# Altium project ZYNQ-7000 SOM Bd.PrjPcb (part 1 of 2)
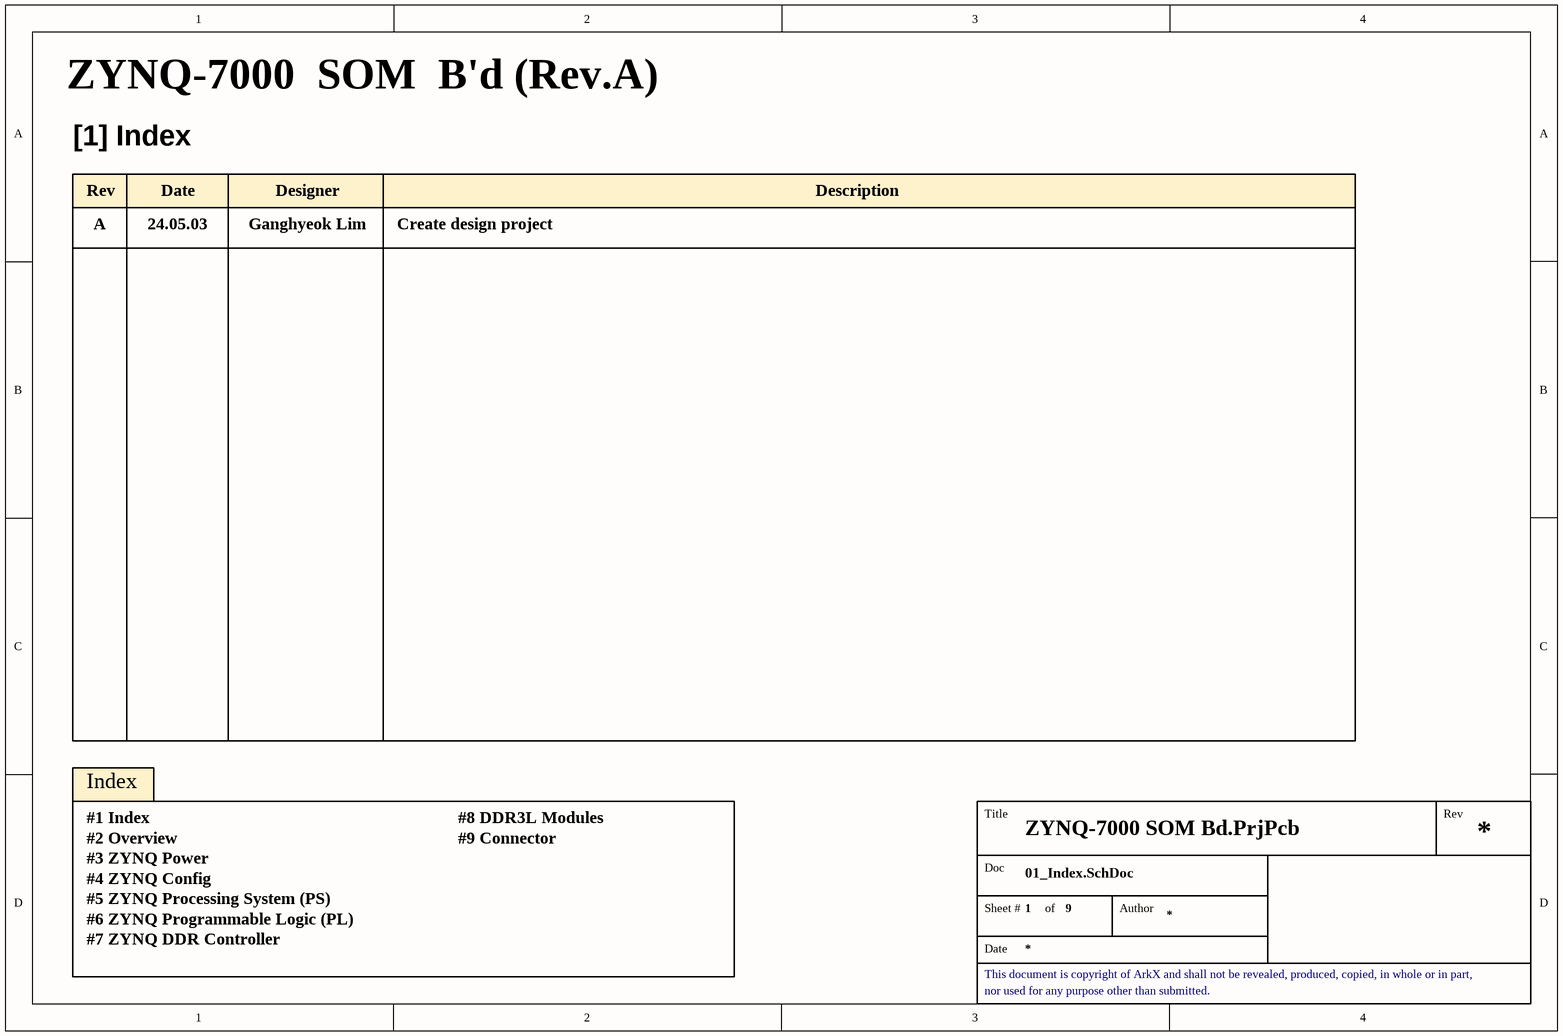
[diagram p0: 01_Index.SchDoc]
9 sheets, 246 parts. Net scope: global (net labels, ports and power ports of the same name join across sheets).
Board file: ZYNQ-7000_SOM_Bd.PcbDoc
Sheets:
  01_Index.SchDoc
  02_Overview.SchDoc
  03_ZYNQ_Power.SchDoc
  04_ZYNQ_Config.SchDoc
  05_ZYNQ_PS.SchDoc
  06_ZYNQ_PL.SchDoc
  07_ZYNQ_DDR.SchDoc
  08_DDR3L_Modules.SchDoc
  09_Connectors.SchDoc

## Sheet 01_Index.SchDoc
size A4; SheetNumber: 1; SheetTotal: 9

### Notes on the sheet
- ZYNQ-7000  SOM  B'd (Rev.A)
- [1] Index
- Rev
- A
- 24.05.03
- Date
- Ganghyeok Lim
- Designer
- Create design project
- Description
- Index
- #1 Index
- #2 Overview
- #8 DDR3L Modules
- #9 Connector
- #3 ZYNQ Power
- #4 ZYNQ Config
- #5 ZYNQ Processing System (PS)
- #6 ZYNQ Programmable Logic (PL)
- #7 ZYNQ DDR Controller
- Title
- Doc
- Sheet #
- of
- Author
- This document is copyright of ArkX and shall not be revealed, produced, copied, in whole or in part,
- nor used for any purpose other than submitted.

## Sheet 02_Overview.SchDoc
size A4; SheetNumber: 2; SheetTotal: 9
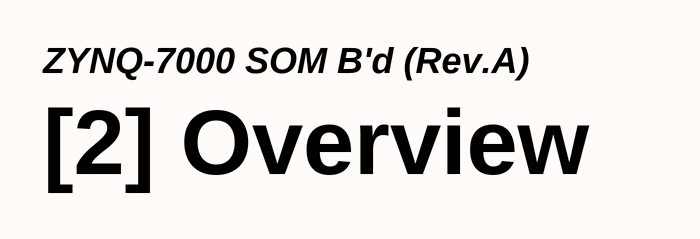
[diagram p1: 02_Overview.SchDoc]

### Notes on the sheet
- ZYNQ-7000 SOM B'd (Rev.A)
- [2] Overview
- Title
- Rev
- Doc
- Sheet #
- of
- Author
- This document is copyright of ArkX and shall not be revealed, produced, copied, in whole or in part,
- Date
- nor used for any purpose other than submitted.

## Sheet 03_ZYNQ_Power.SchDoc
size A2; SheetNumber: 3; SheetTotal: 9
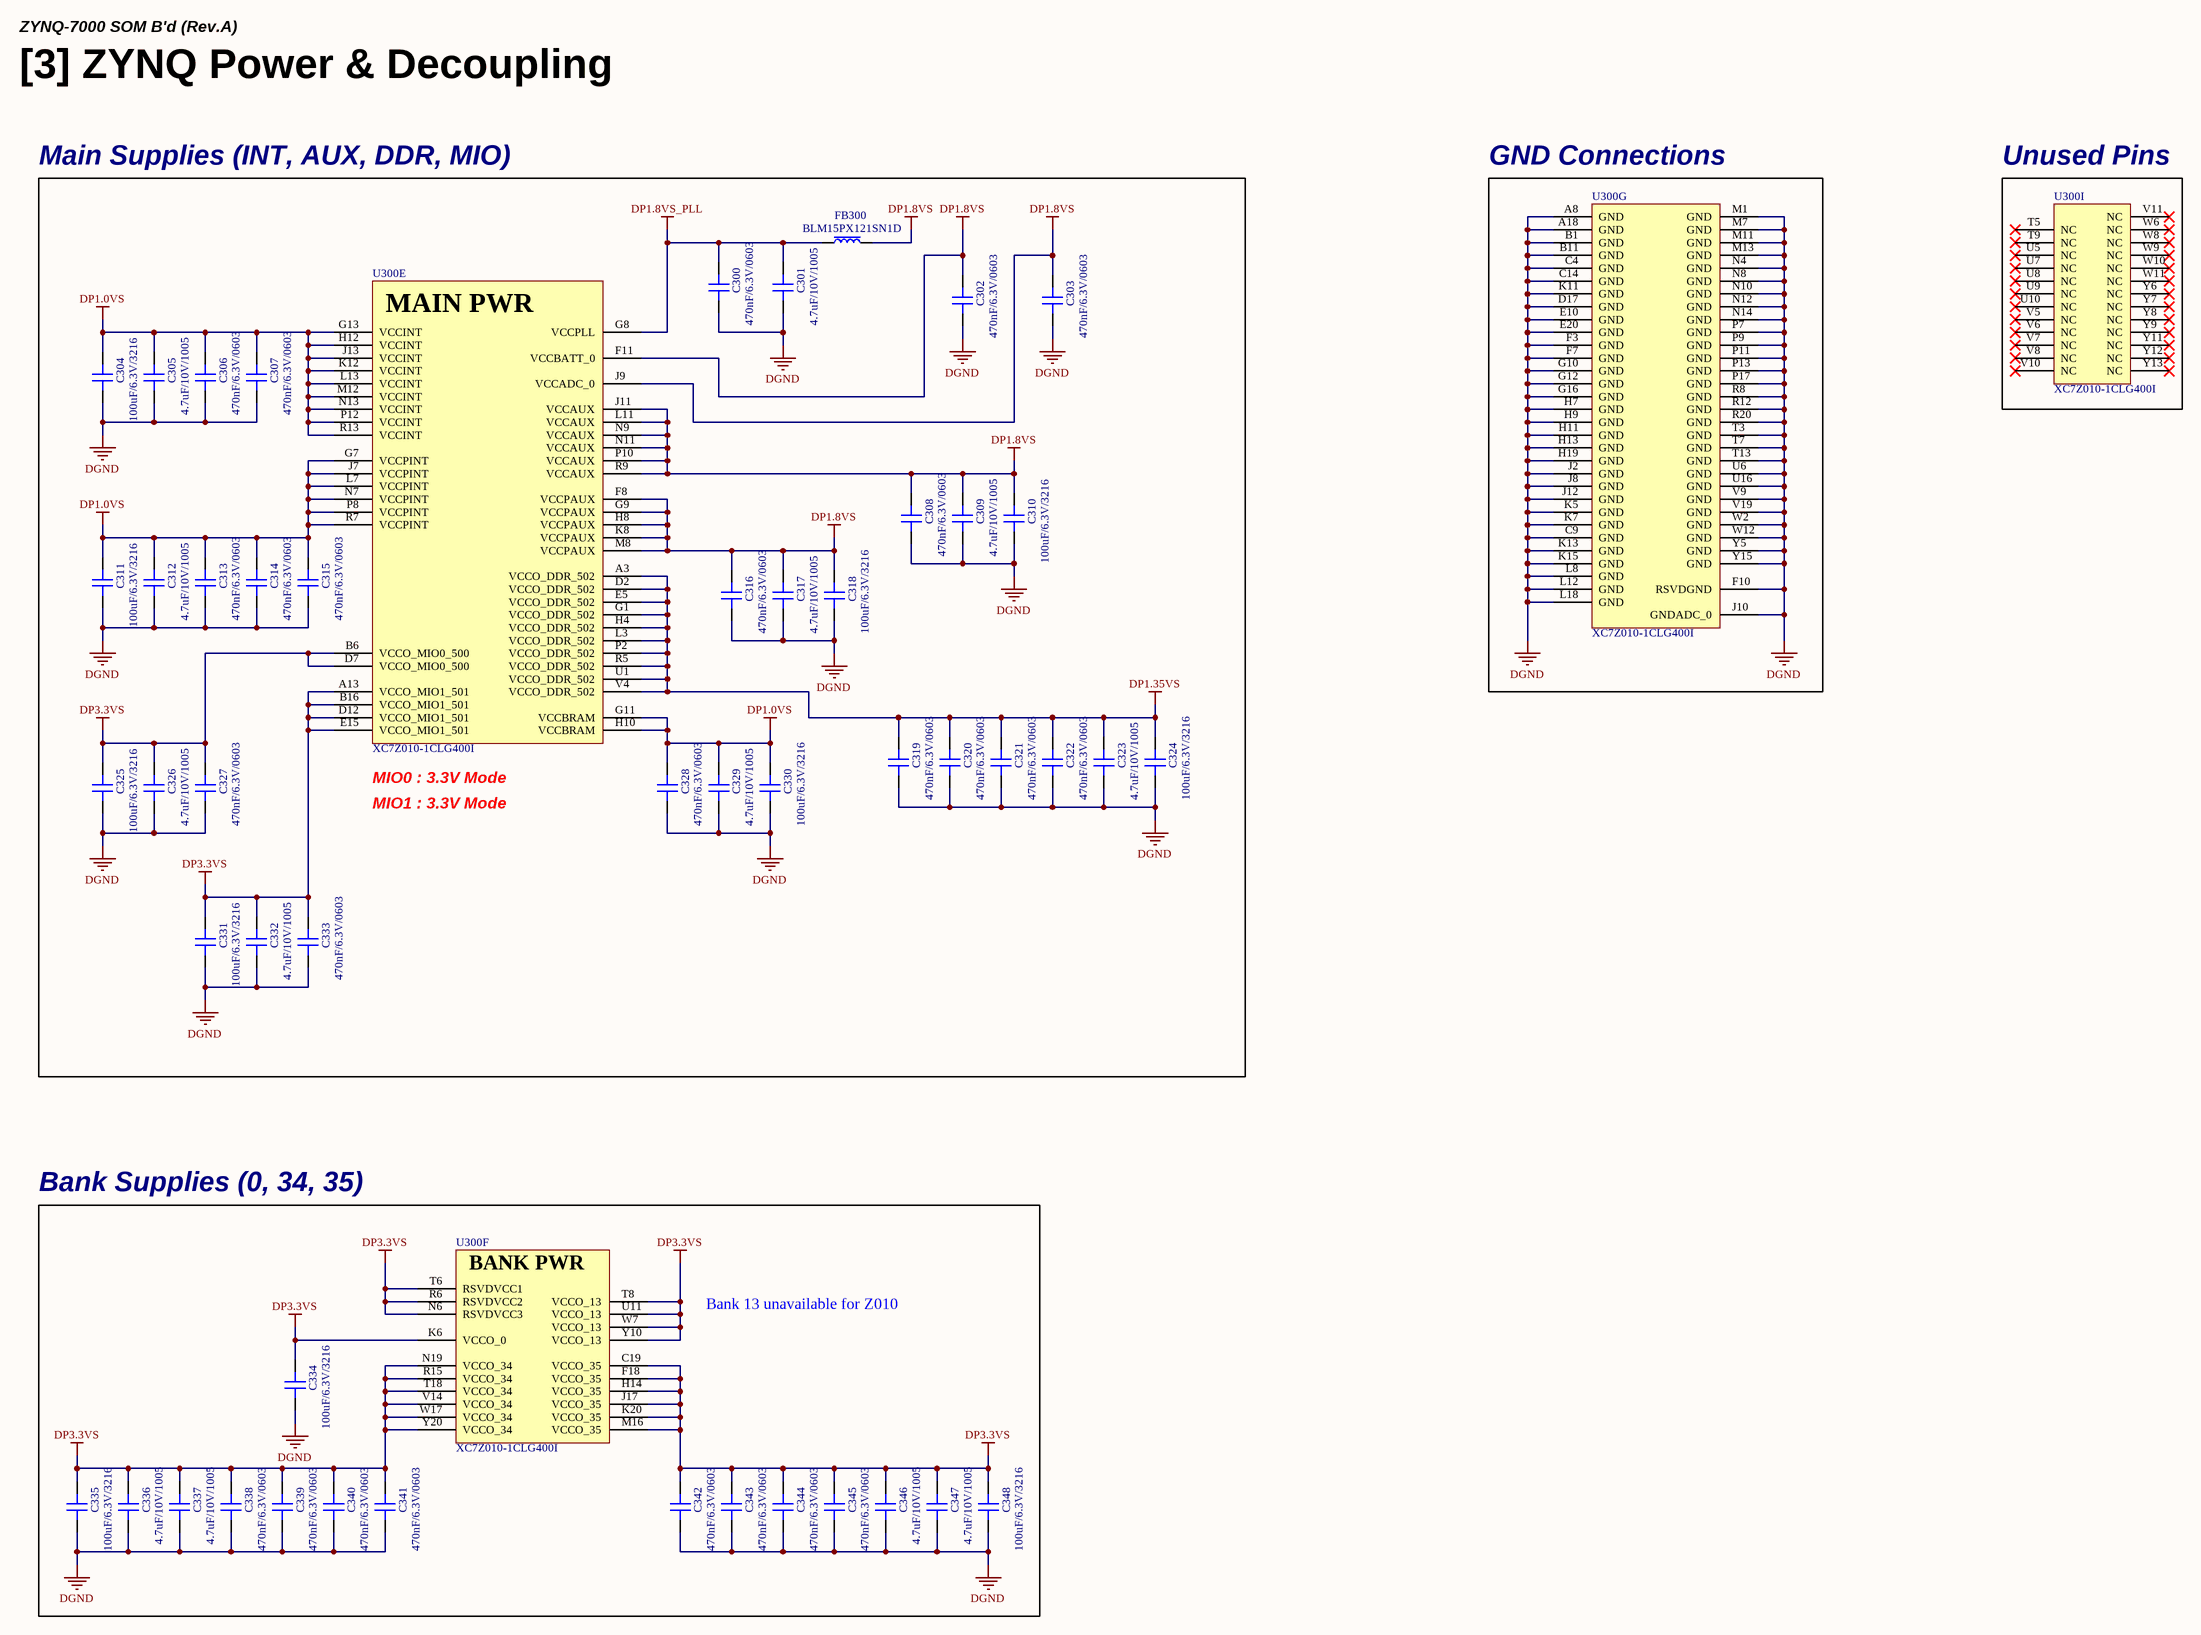
[diagram p2: 03_ZYNQ_Power.SchDoc]

### Parts
C300  470nF/6.3V/0603  [CAP 0603 (0201_INCH)]
C301  4.7uF/10V/1005  [CAP 1005 (0402_INCH)]
C302  470nF/6.3V/0603  [CAP 0603 (0201_INCH)]
C303  470nF/6.3V/0603  [CAP 0603 (0201_INCH)]
C304  100uF/6.3V/3216  [CAP 3216 (1206_INCH) - H1.8MM]
C305  4.7uF/10V/1005  [CAP 1005 (0402_INCH)]
C306  470nF/6.3V/0603  [CAP 0603 (0201_INCH)]
C307  470nF/6.3V/0603  [CAP 0603 (0201_INCH)]
C308  470nF/6.3V/0603  [CAP 0603 (0201_INCH)]
C309  4.7uF/10V/1005  [CAP 1005 (0402_INCH)]
C310  100uF/6.3V/3216  [CAP 3216 (1206_INCH) - H1.8MM]
C311  100uF/6.3V/3216  [CAP 3216 (1206_INCH) - H1.8MM]
C312  4.7uF/10V/1005  [CAP 1005 (0402_INCH)]
C313  470nF/6.3V/0603  [CAP 0603 (0201_INCH)]
C314  470nF/6.3V/0603  [CAP 0603 (0201_INCH)]
C315  470nF/6.3V/0603  [CAP 0603 (0201_INCH)]
C316  470nF/6.3V/0603  [CAP 0603 (0201_INCH)]
C317  4.7uF/10V/1005  [CAP 1005 (0402_INCH)]
C318  100uF/6.3V/3216  [CAP 3216 (1206_INCH) - H1.8MM]
C319  470nF/6.3V/0603  [CAP 0603 (0201_INCH)]
C320  470nF/6.3V/0603  [CAP 0603 (0201_INCH)]
C321  470nF/6.3V/0603  [CAP 0603 (0201_INCH)]
C322  470nF/6.3V/0603  [CAP 0603 (0201_INCH)]
C323  4.7uF/10V/1005  [CAP 1005 (0402_INCH)]
C324  100uF/6.3V/3216  [CAP 3216 (1206_INCH) - H1.8MM]
C325  100uF/6.3V/3216  [CAP 3216 (1206_INCH) - H1.8MM]
C326  4.7uF/10V/1005  [CAP 1005 (0402_INCH)]
C327  470nF/6.3V/0603  [CAP 0603 (0201_INCH)]
C328  470nF/6.3V/0603  [CAP 0603 (0201_INCH)]
C329  4.7uF/10V/1005  [CAP 1005 (0402_INCH)]
C330  100uF/6.3V/3216  [CAP 3216 (1206_INCH) - H1.8MM]
C331  100uF/6.3V/3216  [CAP 3216 (1206_INCH) - H1.8MM]
C332  4.7uF/10V/1005  [CAP 1005 (0402_INCH)]
C333  470nF/6.3V/0603  [CAP 0603 (0201_INCH)]
C334  100uF/6.3V/3216  [CAP 3216 (1206_INCH) - H1.8MM]
C335  100uF/6.3V/3216  [CAP 3216 (1206_INCH) - H1.8MM]
C336  4.7uF/10V/1005  [CAP 1005 (0402_INCH)]
C337  4.7uF/10V/1005  [CAP 1005 (0402_INCH)]
C338  470nF/6.3V/0603  [CAP 0603 (0201_INCH)]
C339  470nF/6.3V/0603  [CAP 0603 (0201_INCH)]
C340  470nF/6.3V/0603  [CAP 0603 (0201_INCH)]
C341  470nF/6.3V/0603  [CAP 0603 (0201_INCH)]
C342  470nF/6.3V/0603  [CAP 0603 (0201_INCH)]
C343  470nF/6.3V/0603  [CAP 0603 (0201_INCH)]
C344  470nF/6.3V/0603  [CAP 0603 (0201_INCH)]
C345  470nF/6.3V/0603  [CAP 0603 (0201_INCH)]
C346  4.7uF/10V/1005  [CAP 1005 (0402_INCH)]
C347  4.7uF/10V/1005  [CAP 1005 (0402_INCH)]
C348  100uF/6.3V/3216  [CAP 3216 (1206_INCH) - H1.8MM]
FB300  BLM15PX121SN1D  [FB 1005 (0402_inch)]
U300  XC7Z010-1CLG400I  [IC_SOC_XC7Z010-1CLG400I]  (parts E,F,G,I of 9)

### Blocks framed on the sheet
Main Supplies (INT, AUX, DDR, MIO): C300-C333 FB300 U300
GND Connections: U300
Unused Pins: U300
Bank Supplies (0, 34, 35): C334-C348 U300

### Nets
DGND: C300.1 C301.1 C302.1 C303.1 C304.1 C305.1 C306.1 C307.1 C308.1 C309.1 C310.1 C311.1 C312.1 C313.1 C314.1 C315.1 C316.1 C317.1 C318.1 C319.1 C320.1 C321.1 C322.1 C323.1 C324.1 C325.1 C326.1 C327.1 C328.1 C329.1 C330.1 C331.1 C332.1 C333.1 C334.1 C335.1 C336.1 C337.1 C338.1 C339.1 C340.1 C341.1 C342.1 C343.1 C344.1 C345.1 C346.1 C347.1 C348.1 U300.A8(GND) U300.A18(GND) U300.B1(GND) U300.B11(GND) U300.C4(GND) U300.C9(GND) U300.C14(GND) U300.D17(GND) U300.E10(GND) U300.E20(GND) U300.F3(GND) U300.F7(GND) U300.F10(RSVDGND) U300.G10(GND) U300.G12(GND) U300.G16(GND) U300.H7(GND) U300.H9(GND) U300.H11(GND) U300.H13(GND) U300.H19(GND) U300.J2(GND) U300.J8(GND) U300.J10(GNDADC_0) U300.J12(GND) U300.K5(GND) U300.K7(GND) U300.K11(GND) U300.K13(GND) U300.K15(GND) U300.L8(GND) U300.L12(GND) U300.L18(GND) U300.M1(GND) U300.M7(GND) U300.M11(GND) U300.M13(GND) U300.N4(GND) U300.N8(GND) U300.N10(GND) U300.N12(GND) U300.N14(GND) U300.P7(GND) U300.P9(GND) U300.P11(GND) U300.P13(GND) U300.P17(GND) U300.R8(GND) U300.R12(GND) U300.R20(GND) U300.T3(GND) U300.T7(GND) U300.T13(GND) U300.U6(GND) U300.U16(GND) U300.V9(GND) U300.V19(GND) U300.W2(GND) U300.W12(GND) U300.Y5(GND) U300.Y15(GND)
DP1.0VS: C304.2 C305.2 C306.2 C307.2 C311.2 C312.2 C313.2 C314.2 C315.2 C328.2 C329.2 C330.2 U300.G7(VCCPINT) U300.G11(VCCBRAM) U300.G13(VCCINT) U300.H10(VCCBRAM) U300.H12(VCCINT) U300.J7(VCCPINT) U300.J13(VCCINT) U300.K12(VCCINT) U300.L7(VCCPINT) U300.L13(VCCINT) U300.M12(VCCINT) U300.N7(VCCPINT) U300.N13(VCCINT) U300.P8(VCCPINT) U300.P12(VCCINT) U300.R7(VCCPINT) U300.R13(VCCINT)
DP1.8VS: C302.2 C303.2 C308.2 C309.2 C310.2 C316.2 C317.2 C318.2 FB300.2 U300.F8(VCCPAUX) U300.F11(VCCBATT_0) U300.G9(VCCPAUX) U300.H8(VCCPAUX) U300.J9(VCCADC_0) U300.J11(VCCAUX) U300.K8(VCCPAUX) U300.L11(VCCAUX) U300.M8(VCCPAUX) U300.N9(VCCAUX) U300.N11(VCCAUX) U300.P10(VCCAUX) U300.R9(VCCAUX)
DP1.8VS_PLL: C300.2 C301.2 FB300.1 U300.G8(VCCPLL)
DP1.35VS: C319.2 C320.2 C321.2 C322.2 C323.2 C324.2 U300.A3(VCCO_DDR_502) U300.D2(VCCO_DDR_502) U300.E5(VCCO_DDR_502) U300.G1(VCCO_DDR_502) U300.H4(VCCO_DDR_502) U300.L3(VCCO_DDR_502) U300.P2(VCCO_DDR_502) U300.R5(VCCO_DDR_502) U300.U1(VCCO_DDR_502) U300.V4(VCCO_DDR_502)
DP3.3VS: C325.2 C326.2 C327.2 C331.2 C332.2 C333.2 C334.2 C335.2 C336.2 C337.2 C338.2 C339.2 C340.2 C341.2 C342.2 C343.2 C344.2 C345.2 C346.2 C347.2 C348.2 U300.A13(VCCO_MIO1_501) U300.B6(VCCO_MIO0_500) U300.B16(VCCO_MIO1_501) U300.C19(VCCO_35) U300.D7(VCCO_MIO0_500) U300.D12(VCCO_MIO1_501) U300.E15(VCCO_MIO1_501) U300.F18(VCCO_35) U300.H14(VCCO_35) U300.J17(VCCO_35) U300.K6(VCCO_0) U300.K20(VCCO_35) U300.M16(VCCO_35) U300.N6(RSVDVCC3) U300.N19(VCCO_34) U300.R6(RSVDVCC2) U300.R15(VCCO_34) U300.T6(RSVDVCC1) U300.T8(VCCO_13) U300.T18(VCCO_34) U300.U11(VCCO_13) U300.V14(VCCO_34) U300.W7(VCCO_13) U300.W17(VCCO_34) U300.Y10(VCCO_13) U300.Y20(VCCO_34)

Not connected (* = marked no-connect by the designer): U300 T5(NC)* T9(NC)* U5(NC)* U7(NC)* U8(NC)* U9(NC)* U10(NC)* V5(NC)* V6(NC)* V7(NC)* V8(NC)* V10(NC)* V11(NC)* W6(NC)* W8(NC)* W9(NC)* W10(NC)* W11(NC)* Y6(NC)* Y7(NC)* Y8(NC)* Y9(NC)* Y11(NC)* Y12(NC)* Y13(NC)*

### Notes on the sheet
- ZYNQ-7000 SOM B'd (Rev.A)
- [3] ZYNQ Power & Decoupling
- (near U300) MIO0 : 3.3V Mode
- MIO1 : 3.3V Mode
- Bank 13 unavailable for Z010
- Title
- Rev
- Doc
- Sheet #
- of
- Author
- This document is copyright of ArkX and shall not be revealed, produced, copied, in whole or in part,
- Date
- nor used for any purpose other than submitted.
- (in symbol IC_SOC_XC7Z010-1CLG400I, part E) MAIN PWR
- (in symbol IC_SOC_XC7Z010-1CLG400I, part F) BANK PWR

### Library data of the parts
C300 C302 C303 C306-C308 C313-C316 C319-C322 C327 C328 C333 C338-C345 = CAP_470nF/6.3V/0603: 6.3V 470nF X5R ±10% 0201  Multilayer Ceramic Capacitors MLCC - SMD/SMT ROHS; LCSC Part #: C85926; JLCPCB Part Type: Extended Part
C301 C305 C309 C312 C317 C323 C326 C329 C332 C336 C337 C346 C347 = CAP_4.7uF/10V/1005: 10V 4.7uF X5R ±20% 0402  Multilayer Ceramic Capacitors MLCC - SMD/SMT ROHS; JLCPCB Part Type: Basic Part; LCSC Part #: C23733
C304 C310 C311 C318 C324 C325 C330 C331 C334 C335 C348 = CAP_100uF/6.3V/3216: Ceramic CAP_100uF/6.3V/3216; LCSC Part #: C15008; JLCPCB Part Type: Basic Part
FB300 = FB_BLM15PX121SN1D: 55mΩ ±25% 120Ω@100MHz 0402  Ferrite Beads ROHS; LCSC Part #: C88970; JLCPCB Part Type: Extended Part
U300 = IC_SOC_XC7Z010-1CLG400I: Dual ARM® Cortex®-A9 MPCore™ with CoreSight™ System On Chip (SOC) IC Zynq®-7000 Artix™-7 FPGA, 28K Logic Cells 766MHz 400-CSPBGA (17x17); LCSC Part #: C2840994; JLCPCB Part Type: Extended Part

## Sheet 04_ZYNQ_Config.SchDoc
size A3; SheetNumber: 4; SheetTotal: 9
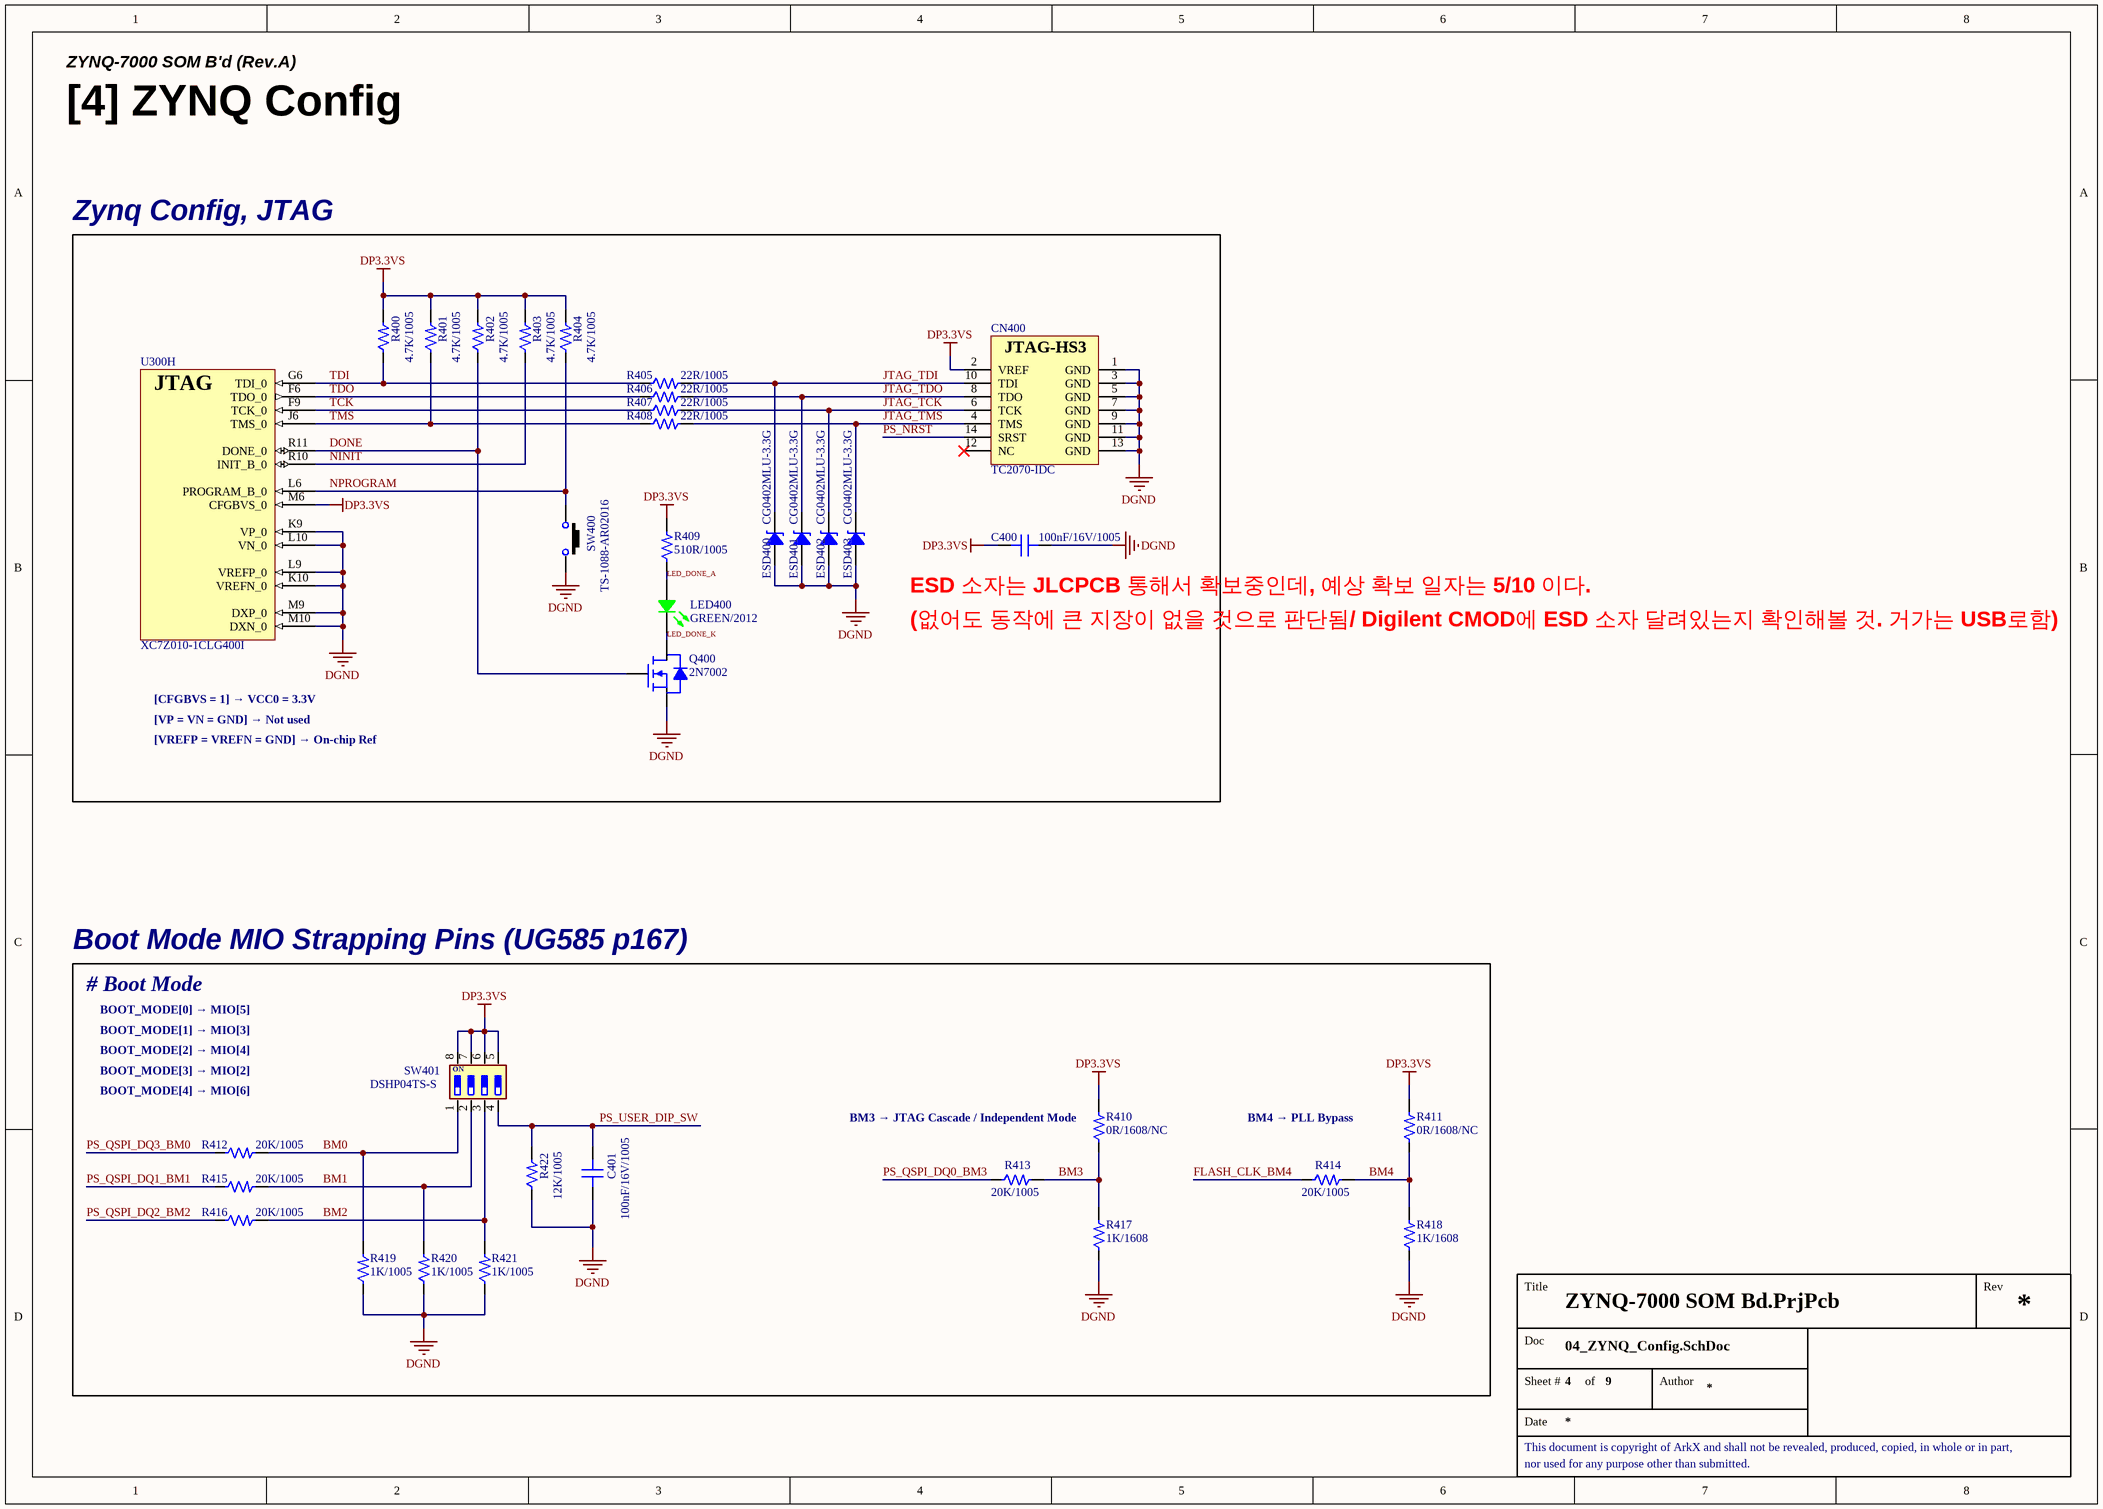
[diagram p3: 04_ZYNQ_Config.SchDoc]

### Parts
C400  100nF/16V/1005  [CAP 1005 (0402_INCH)]
C401  100nF/16V/1005  [CAP 1005 (0402_INCH)]
CN400  TC2070-IDC  [CON_TC2070-IDC]
ESD400  CG0402MLU-3.3G  [RES 1005 (0402_inch)]
ESD401  CG0402MLU-3.3G  [RES 1005 (0402_inch)]
ESD402  CG0402MLU-3.3G  [RES 1005 (0402_inch)]
ESD403  CG0402MLU-3.3G  [RES 1005 (0402_inch)]
LED400  GREEN/2012  [LED MHT170RGBCT (GREEN)]
Q400  2N7002  [SOT 23-3 (DIODES INCORPORATED)]
R400  4.7K/1005  [RES 1005 (0402_inch)]
R401  4.7K/1005  [RES 1005 (0402_inch)]
R402  4.7K/1005  [RES 1005 (0402_inch)]
R403  4.7K/1005  [RES 1005 (0402_inch)]
R404  4.7K/1005  [RES 1005 (0402_inch)]
R405  22R/1005  [RES 1005 (0402_inch)]
R406  22R/1005  [RES 1005 (0402_inch)]
R407  22R/1005  [RES 1005 (0402_inch)]
R408  22R/1005  [RES 1005 (0402_inch)]
R409  510R/1005  [RES 1005 (0402_inch)]
R410  0R/1608/NC  [RES 1608 (0603_inch)/NC]
R411  0R/1608/NC  [RES 1608 (0603_inch)/NC]
R412  20K/1005  [RES 1005 (0402_inch)]
R413  20K/1005  [RES 1005 (0402_inch)]
R414  20K/1005  [RES 1005 (0402_inch)]
R415  20K/1005  [RES 1005 (0402_inch)]
R416  20K/1005  [RES 1005 (0402_inch)]
R417  1K/1608  [RES 1608 (0603_inch)]
R418  1K/1608  [RES 1608 (0603_inch)]
R419  1K/1005  [RES 1005 (0402_inch)]
R420  1K/1005  [RES 1005 (0402_inch)]
R421  1K/1005  [RES 1005 (0402_inch)]
R422  12K/1005  [RES 1005 (0402_inch)]
SW400  TS-1088-AR02016  [SW_TS-1088-AR02016]
SW401  DSHP04TS-S  [SW_DSHP04TS-S]
U300  XC7Z010-1CLG400I  [IC_SOC_XC7Z010-1CLG400I]  (part H of 9)

### Blocks framed on the sheet
Zynq Config, JTAG: C400 CN400 ESD400-ESD403 LED400 Q400 R400-R409 SW400 U300
Boot Mode MIO Strapping Pins (UG585 p167): C401 R410-R422 SW401

### Nets
DGND: C400.1 C401.1 CN400.1(GND) CN400.3(GND) CN400.5(GND) CN400.7(GND) CN400.9(GND) CN400.11(GND) CN400.13(GND) ESD400.1 ESD401.1 ESD402.1 ESD403.1 Q400.2(S) R417.1 R418.1 R419.1 R420.1 R421.1 R422.1 SW400.2 U300.K9(VP_0) U300.K10(VREFN_0) U300.L9(VREFP_0) U300.L10(VN_0) U300.M9(DXP_0) U300.M10(DXN_0)
DP3.3VS: C400.2 CN400.2(VREF) R400.2 R401.2 R402.2 R403.2 R404.2 R409.2 R410.2 R411.2 SW401.5 SW401.6 SW401.7 SW401.8 U300.M6(CFGBVS_0)
BM0: R412.2 R419.2 SW401.1
BM1: R415.2 R420.2 SW401.2
BM2: R416.2 R421.2 SW401.3
BM3: R410.1 R413.2 R417.2
BM4: R411.1 R414.2 R418.2
DONE: Q400.1(G) R402.1 U300.R11(DONE_0)
FLASH_CLK_BM4: R414.1
JTAG_TCK: CN400.6(TCK) ESD402.2 R407.2
JTAG_TDI: CN400.10(TDI) ESD400.2 R405.2
JTAG_TDO: CN400.8(TDO) ESD401.2 R406.2
JTAG_TMS: CN400.4(TMS) ESD403.2 R408.2
LED_DONE_A: LED400.4(Common_Anode) R409.1
LED_DONE_K: LED400.2(GREEN) Q400.3(D)
NINIT: R403.1 U300.R10(INIT_B_0)
NPROGRAM: R404.1 SW400.1 U300.L6(PROGRAM_B_0)
PS_NRST: CN400.14(SRST)
PS_QSPI_DQ0_BM3: R413.1
PS_QSPI_DQ1_BM1: R415.1
PS_QSPI_DQ2_BM2: R416.1
PS_QSPI_DQ3_BM0: R412.1
PS_USER_DIP_SW: C401.2 R422.2 SW401.4
TCK: R407.1 U300.F9(TCK_0)
TDI: R400.1 R405.1 U300.G6(TDI_0)
TDO: R406.1 U300.F6(TDO_0)
TMS: R401.1 R408.1 U300.J6(TMS_0)

Not connected (* = marked no-connect by the designer): CN400 12(NC)*

### Notes on the sheet
- ZYNQ-7000 SOM B'd (Rev.A)
- [4] ZYNQ Config
- (near C400) ESD 소자는 JLCPCB 통해서 확보중인데, 예상 확보 일자는 5/10 이다.
- (없어도 동작에 큰 지장이 없을 것으로 판단됨/ Digilent CMOD에 ESD 소자 달려있는지 확인해볼 것. 거가는 USB로함)
- [CFGBVS = 1] → VCC0 = 3.3V
- [VP = VN = GND] → Not used
- [VREFP = VREFN = GND] → On-chip Ref
- # Boot Mode
- BOOT_MODE[0] → MIO[5]
- BOOT_MODE[1] → MIO[3]
- BOOT_MODE[2] → MIO[4]
- BOOT_MODE[3] → MIO[2]
- BOOT_MODE[4] → MIO[6]
- (near R410) BM3 → JTAG Cascade / Independent Mode
- BM4 → PLL Bypass
- Title
- Rev
- Doc
- Sheet #
- of
- Author
- This document is copyright of ArkX and shall not be revealed, produced, copied, in whole or in part,
- Date
- nor used for any purpose other than submitted.
- (in symbol CON_TC2070-IDC(JTAG-HS3)) JTAG-HS3
- (in symbol IC_SOC_XC7Z010-1CLG400I, part H) JTAG
- (in symbol SW_DSHP04TS-S) ON

### Library data of the parts
C400 C401 = CAP_100nF/16V/1005: Ceramic CAP_100nF/16V/1005; LCSC Part #: C1525; JLCPCB Part Type: Basic Part
CN400 = CON_TC2070-IDC(JTAG-HS3): TC2070 14-pin Plug-of-Nails™ (with legs) to 14 pin 2mm female IDC connector.
ESD400-ESD403 = ESD_CG0402MLU-3.3G: Varistor 1 Circuit Surface Mount, MLCV 0402 (1005 Metric); LCSC Part #: C2655393; JLCPCB Part Type: Extended Part
LED400 = LED_MHT170RGBCT(GREEN): Colorless transparence -30℃~+85℃ Positive post Common anode RGB 120° 0805  Light Emitting Diodes (LED) ROHS; LCSC Part #: C2962094; JLCPCB Part Type: Extended Part
Q400 = FET_2N7002: 60V 115mA 200mW 7.5Ω@10V,500mA N Channel SOT-23  MOSFETs ROHS; LCSC Part #: C8545; JLCPCB Part Type: Basic Part
R400-R404 = RES_4.7K/1005/62.5mW: Value: 4.7K; Power Rating: 62.5mW; Precision: 1%; Size: 1005; LCSC Part #: C25900; JLCPCB Part Type: Basic Part
R405-R408 = RES_22R/1005/62.5mW: Value: 22R; Power Rating: 62.5mW; Precision: 1%; Size: 1005; LCSC Part #: C25092; JLCPCB Part Type: Basic Part
R409 = RES_510R/1005/62.5mW: Value: 510R; Power Rating: 62.5mW; Precision: 1%; Size: 1005; LCSC Part #: C25123; JLCPCB Part Type: Basic Part
R410 R411 = RES_NC_0R/1608/0.1W: 0R/1608/0.1W/NC; Value: 0R; Power Rating: 0.1W; Precision: 1%; Size: 1608
R412-R416 = RES_20K/1005/62.5mW: Value: 20K; Power Rating: 62.5mW; Precision: 1%; Size: 1005; LCSC Part #: C25765; JLCPCB Part Type: Basic Part
R417 R418 = RES_1K/1608/0.1W: Value: 1K; Power Rating: 0.1W; Precision: 1%; Size: 1608; LCSC Part #: C21190; JLCPCB Part Type: Basic Part
R419-R421 = RES_1K/1005/62.5mW: Value: 1K; Power Rating: 62.5mW; Precision: 1%; Size: 1005; LCSC Part #: C11702; JLCPCB Part Type: Basic Part
R422 = RES_12K/1005/62.5mW: Value: 12K; Power Rating: 62.5mW; Precision: 1%; Size: 1005; LCSC Part #: C25752; JLCPCB Part Type: Basic Part
SW400 = SW_TS-1088-AR02016: NO 50mA 100MΩ 100000 Times 12V 160gf@±50gf Brick nogging SPST SMD  Tactile Switches ROHS; LCSC Part #: C720477; JLCPCB Part Type: Extended Part
SW401 = SW_DSHP04TS-S: 4Bit SPST 24V 25mA Black 3千次 Slide (Standard),凹槽式 SMD-8P,5.4x6.7mm  DIP Switches ROHS; LCSC Part #: C319050; JLCPCB Part Type: Extended Part
U300 = IC_SOC_XC7Z010-1CLG400I: as U300 on sheet 03_ZYNQ_Power; LCSC Part #: C2840994; JLCPCB Part Type: Extended Part

## Sheet 05_ZYNQ_PS.SchDoc
size A3; SheetNumber: 5; SheetTotal: 9
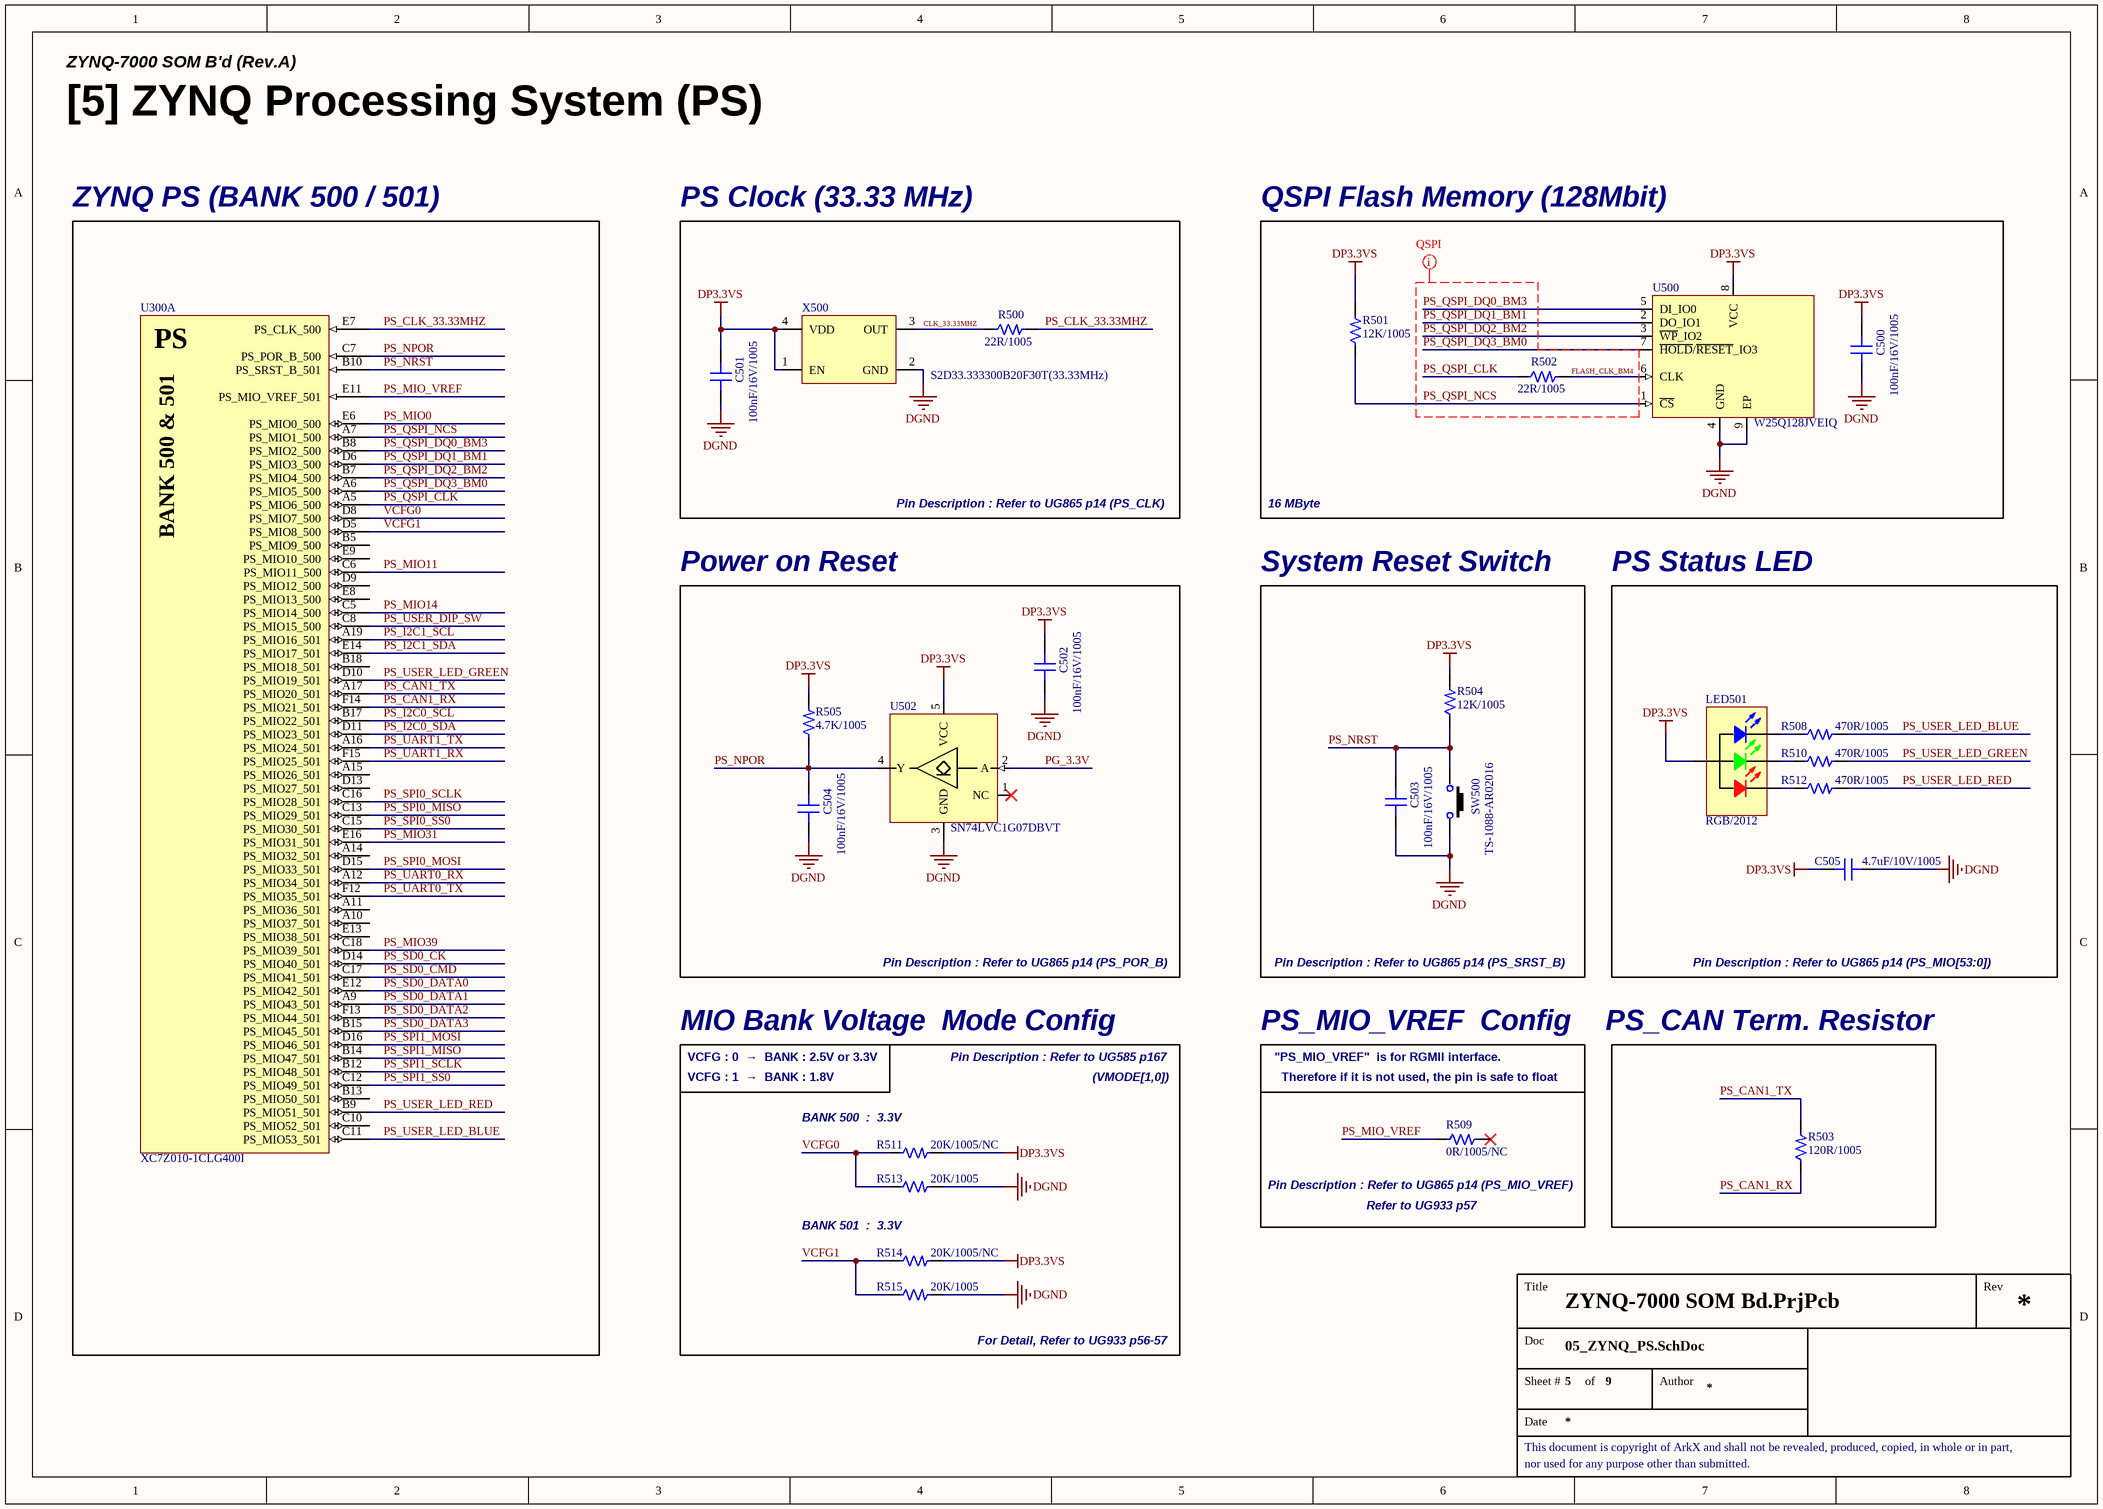
[diagram p4: 05_ZYNQ_PS.SchDoc]

### Parts
C500  100nF/16V/1005  [CAP 1005 (0402_INCH)]
C501  100nF/16V/1005  [CAP 1005 (0402_INCH)]
C502  100nF/16V/1005  [CAP 1005 (0402_INCH)]
C503  100nF/16V/1005  [CAP 1005 (0402_INCH)]
C504  100nF/16V/1005  [CAP 1005 (0402_INCH)]
C505  4.7uF/10V/1005  [CAP 1005 (0402_INCH)]
LED501  RGB/2012  [LED MHT170RGBCT]
R500  22R/1005  [RES 1005 (0402_inch)]
R501  12K/1005  [RES 1005 (0402_inch)]
R502  22R/1005  [RES 1005 (0402_inch)]
R503  120R/1005  [RES 1005 (0402_inch)]
R504  12K/1005  [RES 1005 (0402_inch)]
R505  4.7K/1005  [RES 1005 (0402_inch)]
R508  470R/1005  [RES 1005 (0402_inch)]
R509  0R/1005/NC  [RES 1005 (0402_inch)/NC]
R510  470R/1005  [RES 1005 (0402_inch)]
R511  20K/1005/NC  [RES 1005 (0402_inch)/NC]
R512  470R/1005  [RES 1005 (0402_inch)]
R513  20K/1005  [RES 1005 (0402_inch)]
R514  20K/1005/NC  [RES 1005 (0402_inch)/NC]
R515  20K/1005  [RES 1005 (0402_inch)]
SW500  TS-1088-AR02016  [SW_TS-1088-AR02016]
U300  XC7Z010-1CLG400I  [IC_SOC_XC7Z010-1CLG400I]  (part A of 9)
U500  W25Q128JVEIQ  [IC_WSON-8-8X6]
U502  SN74LVC1G07DBVT  [SOT-23-5 (TI DBV PACKAGE)]
X500  S2D33.333300B20F30T(33.33MHz)  [OSC SMD_2.5x2.0 (SCTF)]

### Blocks framed on the sheet
ZYNQ PS (BANK 500 / 501): U300
PS Clock (33.33 MHz): C501 R500 X500
QSPI Flash Memory (128Mbit): C500 R501 R502 U500
Power on Reset: C502 C504 R505 U502
System Reset Switch: C503 R504 SW500
PS Status LED: C505 LED501 R508 R510 R512
MIO Bank Voltage  Mode Config: R511 R513-R515
PS_MIO_VREF  Config: R509

### Nets
DGND: C500.2 C501.2 C502.2 C503.2 C504.2 C505.1 R513.2 R515.2 SW500.2 U500.4(GND) U500.9(EP) U502.3(GND) X500.2(GND)
DP3.3VS: C500.1 C501.1 C502.1 C505.2 LED501.4(Common_Anode) R501.2 R504.2 R505.2 R511.2 R514.2 U500.8(VCC) U502.5(VCC) X500.1(EN) X500.4(VDD)
CLK_33.33MHZ: R500.1 X500.3(OUT)
FLASH_CLK_BM4: R502.2 U500.6(CLK)
PG_3.3V: U502.2(A)
PS_CAN1_RX: R503.1 U300.F14(PS_MIO21_501)
PS_CAN1_TX: R503.2 U300.A17(PS_MIO20_501)
PS_CLK_33.33MHZ: R500.2 U300.E7(PS_CLK_500)
PS_I2C0_SCL: U300.B17(PS_MIO22_501)
PS_I2C0_SDA: U300.D11(PS_MIO23_501)
PS_I2C1_SCL: U300.A19(PS_MIO16_501)
PS_I2C1_SDA: U300.E14(PS_MIO17_501)
PS_MIO0: U300.E6(PS_MIO0_500)
PS_MIO11: U300.C6(PS_MIO11_500)
PS_MIO14: U300.C5(PS_MIO14_500)
PS_MIO31: U300.E16(PS_MIO31_501)
PS_MIO39: U300.C18(PS_MIO39_501)
PS_MIO_VREF: R509.1 U300.E11(PS_MIO_VREF_501)
PS_NPOR: C504.1 R505.1 U300.C7(PS_POR_B_500) U502.4(Y)
PS_NRST: C503.1 R504.1 SW500.1 U300.B10(PS_SRST_B_501)
PS_QSPI_CLK: R502.1 U300.A5(PS_MIO6_500)
PS_QSPI_DQ0_BM3: U300.B8(PS_MIO2_500) U500.5(DI_IO0)
PS_QSPI_DQ1_BM1: U300.D6(PS_MIO3_500) U500.2(DO_IO1)
PS_QSPI_DQ2_BM2: U300.B7(PS_MIO4_500) U500.3(~{WP}_IO2)
PS_QSPI_DQ3_BM0: U300.A6(PS_MIO5_500) U500.7(~{HOLD}/~{RESET}_IO3)
PS_QSPI_NCS: R501.1 U300.A7(PS_MIO1_500) U500.1(~{CS})
PS_SD0_CK: U300.D14(PS_MIO40_501)
PS_SD0_CMD: U300.C17(PS_MIO41_501)
PS_SD0_DATA0: U300.E12(PS_MIO42_501)
PS_SD0_DATA1: U300.A9(PS_MIO43_501)
PS_SD0_DATA2: U300.F13(PS_MIO44_501)
PS_SD0_DATA3: U300.B15(PS_MIO45_501)
PS_SPI0_MISO: U300.C13(PS_MIO29_501)
PS_SPI0_MOSI: U300.D15(PS_MIO33_501)
PS_SPI0_SCLK: U300.C16(PS_MIO28_501)
PS_SPI0_SS0: U300.C15(PS_MIO30_501)
PS_SPI1_MISO: U300.B14(PS_MIO47_501)
PS_SPI1_MOSI: U300.D16(PS_MIO46_501)
PS_SPI1_SCLK: U300.B12(PS_MIO48_501)
PS_SPI1_SS0: U300.C12(PS_MIO49_501)
PS_UART0_RX: U300.A12(PS_MIO34_501)
PS_UART0_TX: U300.F12(PS_MIO35_501)
PS_UART1_RX: U300.F15(PS_MIO25_501)
PS_UART1_TX: U300.A16(PS_MIO24_501)
PS_USER_DIP_SW: U300.C8(PS_MIO15_500)
PS_USER_LED_BLUE: R508.2 U300.C11(PS_MIO53_501)
PS_USER_LED_GREEN: R510.2 U300.D10(PS_MIO19_501)
PS_USER_LED_RED: R512.2 U300.B9(PS_MIO51_501)
VCFG0: R511.1 R513.1 U300.D8(PS_MIO7_500)
VCFG1: R514.1 R515.1 U300.D5(PS_MIO8_500)
NetLED501_1: LED501.1(RED) R512.1
NetLED501_2: LED501.2(GREEN) R510.1
NetLED501_3: LED501.3(BLUE) R508.1

Not connected (* = marked no-connect by the designer): R509 2*; U300 A10(PS_MIO37_501) A11(PS_MIO36_501) A14(PS_MIO32_501) A15(PS_MIO26_501) B5(PS_MIO9_500) B13(PS_MIO50_501) B18(PS_MIO18_501) C10(PS_MIO52_501) D9(PS_MIO12_500) D13(PS_MIO27_501) E8(PS_MIO13_500) E9(PS_MIO10_500) E13(PS_MIO38_501); U502 1(NC)*

### Layout directives
rule Matched Net Lengths [Delay Tolerance = 20ps]; net class QSPI: FLASH_CLK_BM4, PS_QSPI_CLK, PS_QSPI_DQ0_BM3, PS_QSPI_DQ1_BM1, PS_QSPI_DQ2_BM2, PS_QSPI_DQ3_BM0, PS_QSPI_NCS

### Notes on the sheet
- ZYNQ-7000 SOM B'd (Rev.A)
- [5] ZYNQ Processing System (PS)
- Pin Description : Refer to UG865 p14 (PS_CLK)
- 16 MByte
- Pin Description : Refer to UG865 p14 (PS_POR_B)
- Pin Description : Refer to UG865 p14 (PS_SRST_B)
- Pin Description : Refer to UG865 p14 (PS_MIO[53:0])
- PS_CAN Term. Resistor
- VCFG : 0  →  BANK : 2.5V or 3.3V
- VCFG : 1  →  BANK : 1.8V
- (near R511) BANK 500  :  3.3V
- Pin Description : Refer to UG585 p167
- (VMODE[1,0])
- "PS_MIO_VREF"  is for RGMII interface.
- Therefore if it is not used, the pin is safe to float
- (near R509) Pin Description : Refer to UG865 p14 (PS_MIO_VREF)
- BANK 501  :  3.3V
- Refer to UG933 p57
- For Detail, Refer to UG933 p56-57
- Title
- Rev
- Doc
- Sheet #
- of
- Author
- This document is copyright of ArkX and shall not be revealed, produced, copied, in whole or in part,
- Date
- nor used for any purpose other than submitted.
- (in symbol IC_SOC_XC7Z010-1CLG400I, part A) PS; BANK 500 & 501

### Library data of the parts
C500-C504 = CAP_100nF/16V/1005: Ceramic CAP_100nF/16V/1005; LCSC Part #: C1525; JLCPCB Part Type: Basic Part
C505 = CAP_4.7uF/10V/1005: as C301 on sheet 03_ZYNQ_Power; JLCPCB Part Type: Basic Part; LCSC Part #: C23733
LED501 = LED_RGB_MHT170RGBCT: Colorless transparence -30℃~+85℃ Positive post Common anode RGB 120° 0805  Light Emitting Diodes (LED) ROHS; LCSC Part #: C2962094; JLCPCB Part Type: Extended Part
R500 R502 = RES_22R/1005/62.5mW: as R405 on sheet 04_ZYNQ_Config; Size: 1005; LCSC Part #: C25092; JLCPCB Part Type: Basic Part
R501 R504 = RES_12K/1005/62.5mW: as R422 on sheet 04_ZYNQ_Config; Size: 1005; LCSC Part #: C25752; JLCPCB Part Type: Basic Part
R503 = RES_120R/1005/62.5mW: Value: 120R; Power Rating: 62.5mW; Precision: 1%; Size: 1005; LCSC Part #: C25079; JLCPCB Part Type: Basic Part
R505 = RES_4.7K/1005/62.5mW: as R400 on sheet 04_ZYNQ_Config; Size: 1005; LCSC Part #: C25900; JLCPCB Part Type: Basic Part
R508 R510 R512 = RES_470R/1005/62.5mW: Value: 470R; Power Rating: 62.5mW; Precision: 1%; Size: 1005; LCSC Part #: C25117; JLCPCB Part Type: Basic Part
R509 = RES_NC_0R/1005/62.5mW: RES_0R/1005/62.5mW/NC; Value: 0R; Power Rating: 62.5mW; Precision: 1%; Size: 1005
R511 R514 = RES_NC_20K/1005/62.5mW: RES_20K/1005/62.5mW/NC; Value: 20K; Power Rating: 62.5mW; Precision: 1%; Size: 1005
R513 R515 = RES_20K/1005/62.5mW: as R412 on sheet 04_ZYNQ_Config; Size: 1005; LCSC Part #: C25765; JLCPCB Part Type: Basic Part
SW500 = SW_TS-1088-AR02016: as SW400 on sheet 04_ZYNQ_Config; LCSC Part #: C720477; JLCPCB Part Type: Extended Part
U300 = IC_SOC_XC7Z010-1CLG400I: as U300 on sheet 03_ZYNQ_Power; LCSC Part #: C2840994; JLCPCB Part Type: Extended Part
U500 = IC_MEM_W25Q128JVEIQ: 3V 128M-BIT SERIAL FLASH MEMORY WITH DUAL/QUAD SPI & QPI & DTR WSON-8; Manufacturer: Winbond; Manufacturer Part Number: W25Q128JVEIQ; LCSC Part #: C401662; JLCPCB Part Type: Extended Part
U502 = IC_BUF_SN74LVC1G07DBVT: Single Buffer/Driver With Open-Drain Output / IC BUF NON-INVERT 5.5V SOT23-5; LCSC Part #: C2867373; JLCPCB Part Type: Extended Part
X500 = OSC_S2D33.333300B20F30T(33.33MHz): 3.3V ±20ppm CMOS 33.3333MHz SMD2520-4P  Oscillators ROHS; LCSC Part #: C907622; JLCPCB Part Type: Extended Part

## Sheet 06_ZYNQ_PL.SchDoc
size A3; SheetNumber: 6; SheetTotal: 9
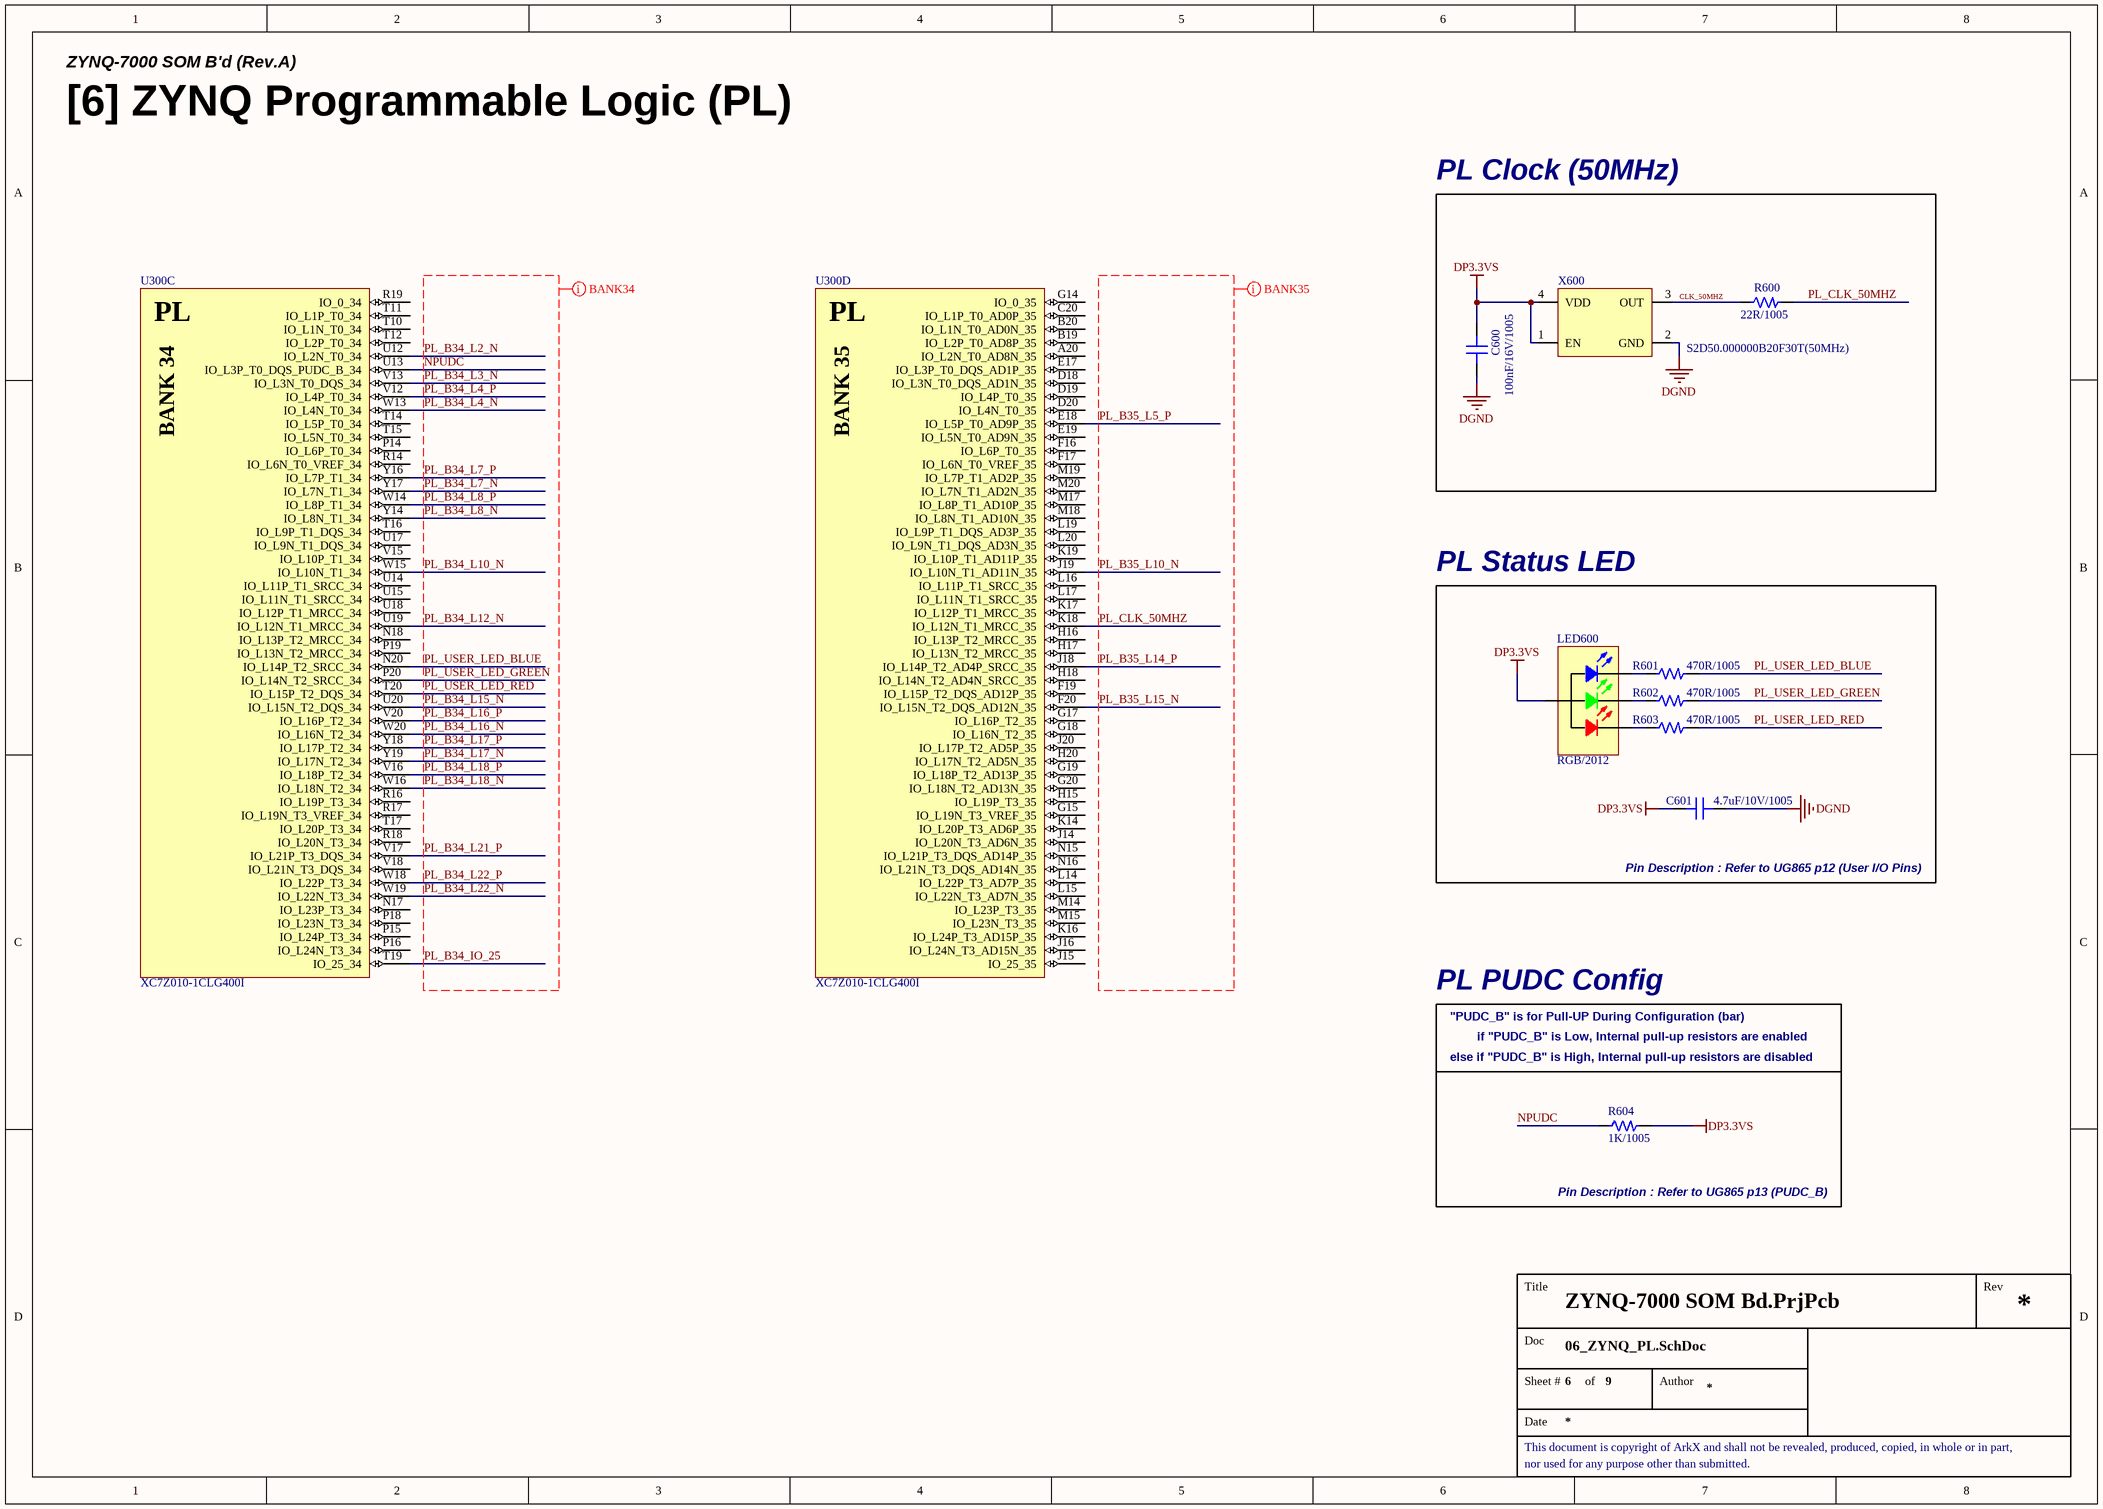
[diagram p5: 06_ZYNQ_PL.SchDoc]

### Parts
C600  100nF/16V/1005  [CAP 1005 (0402_INCH)]
C601  4.7uF/10V/1005  [CAP 1005 (0402_INCH)]
LED600  RGB/2012  [LED MHT170RGBCT]
R600  22R/1005  [RES 1005 (0402_inch)]
R601  470R/1005  [RES 1005 (0402_inch)]
R602  470R/1005  [RES 1005 (0402_inch)]
R603  470R/1005  [RES 1005 (0402_inch)]
R604  1K/1005  [RES 1005 (0402_inch)]
U300  XC7Z010-1CLG400I  [IC_SOC_XC7Z010-1CLG400I]  (parts C,D of 9)
X600  S2D50.000000B20F30T(50MHz)  [OSC SMD_2.5x2.0 (SCTF)]

### Blocks framed on the sheet
PL Clock (50MHz): C600 R600 X600
PL Status LED: C601 LED600 R601-R603
PL PUDC Config: R604

### Nets
DGND: C600.2 C601.1 X600.2(GND)
DP3.3VS: C600.1 C601.2 LED600.4(Common_Anode) R604.2 X600.1(EN) X600.4(VDD)
CLK_50MHZ: R600.1 X600.3(OUT)
NPUDC: R604.1 U300.U13(IO_L3P_T0_DQS_PUDC_B_34)
PL_B34_IO_25: U300.T19(IO_25_34)
PL_B34_L2_N: U300.U12(IO_L2N_T0_34)
PL_B34_L3_N: U300.V13(IO_L3N_T0_DQS_34)
PL_B34_L4_N: U300.W13(IO_L4N_T0_34)
PL_B34_L4_P: U300.V12(IO_L4P_T0_34)
PL_B34_L7_N: U300.Y17(IO_L7N_T1_34)
PL_B34_L7_P: U300.Y16(IO_L7P_T1_34)
PL_B34_L8_N: U300.Y14(IO_L8N_T1_34)
PL_B34_L8_P: U300.W14(IO_L8P_T1_34)
PL_B34_L10_N: U300.W15(IO_L10N_T1_34)
PL_B34_L12_N: U300.U19(IO_L12N_T1_MRCC_34)
PL_B34_L15_N: U300.U20(IO_L15N_T2_DQS_34)
PL_B34_L16_N: U300.W20(IO_L16N_T2_34)
PL_B34_L16_P: U300.V20(IO_L16P_T2_34)
PL_B34_L17_N: U300.Y19(IO_L17N_T2_34)
PL_B34_L17_P: U300.Y18(IO_L17P_T2_34)
PL_B34_L18_N: U300.W16(IO_L18N_T2_34)
PL_B34_L18_P: U300.V16(IO_L18P_T2_34)
PL_B34_L21_P: U300.V17(IO_L21P_T3_DQS_34)
PL_B34_L22_N: U300.W19(IO_L22N_T3_34)
PL_B34_L22_P: U300.W18(IO_L22P_T3_34)
PL_B35_L5_P: U300.E18(IO_L5P_T0_AD9P_35)
PL_B35_L10_N: U300.J19(IO_L10N_T1_AD11N_35)
PL_B35_L14_P: U300.J18(IO_L14P_T2_AD4P_SRCC_35)
PL_B35_L15_N: U300.F20(IO_L15N_T2_DQS_AD12N_35)
PL_CLK_50MHZ: R600.2 U300.K18(IO_L12N_T1_MRCC_35)
PL_USER_LED_BLUE: R601.2 U300.N20(IO_L14P_T2_SRCC_34)
PL_USER_LED_GREEN: R602.2 U300.P20(IO_L14N_T2_SRCC_34)
PL_USER_LED_RED: R603.2 U300.T20(IO_L15P_T2_DQS_34)
NetLED600_1: LED600.1(RED) R603.1
NetLED600_2: LED600.2(GREEN) R602.1
NetLED600_3: LED600.3(BLUE) R601.1

Not connected (* = marked no-connect by the designer): U300 A20(IO_L2N_T0_AD8N_35) B19(IO_L2P_T0_AD8P_35) B20(IO_L1N_T0_AD0N_35) C20(IO_L1P_T0_AD0P_35) D18(IO_L3N_T0_DQS_AD1N_35) D19(IO_L4P_T0_35) D20(IO_L4N_T0_35) E17(IO_L3P_T0_DQS_AD1P_35) E19(IO_L5N_T0_AD9N_35) F16(IO_L6P_T0_35) F17(IO_L6N_T0_VREF_35) F19(IO_L15P_T2_DQS_AD12P_35) G14(IO_0_35) G15(IO_L19N_T3_VREF_35) G17(IO_L16P_T2_35) G18(IO_L16N_T2_35) G19(IO_L18P_T2_AD13P_35) G20(IO_L18N_T2_AD13N_35) H15(IO_L19P_T3_35) H16(IO_L13P_T2_MRCC_35) H17(IO_L13N_T2_MRCC_35) H18(IO_L14N_T2_AD4N_SRCC_35) H20(IO_L17N_T2_AD5N_35) J14(IO_L20N_T3_AD6N_35) J15(IO_25_35) J16(IO_L24N_T3_AD15N_35) J20(IO_L17P_T2_AD5P_35) K14(IO_L20P_T3_AD6P_35) K16(IO_L24P_T3_AD15P_35) K17(IO_L12P_T1_MRCC_35) K19(IO_L10P_T1_AD11P_35) L14(IO_L22P_T3_AD7P_35) L15(IO_L22N_T3_AD7N_35) L16(IO_L11P_T1_SRCC_35) L17(IO_L11N_T1_SRCC_35) L19(IO_L9P_T1_DQS_AD3P_35) L20(IO_L9N_T1_DQS_AD3N_35) M14(IO_L23P_T3_35) M15(IO_L23N_T3_35) M17(IO_L8P_T1_AD10P_35) M18(IO_L8N_T1_AD10N_35) M19(IO_L7P_T1_AD2P_35) M20(IO_L7N_T1_AD2N_35) N15(IO_L21P_T3_DQS_AD14P_35) N16(IO_L21N_T3_DQS_AD14N_35) N17(IO_L23P_T3_34) N18(IO_L13P_T2_MRCC_34) P14(IO_L6P_T0_34) P15(IO_L24P_T3_34) P16(IO_L24N_T3_34) P18(IO_L23N_T3_34) P19(IO_L13N_T2_MRCC_34) R14(IO_L6N_T0_VREF_34) R16(IO_L19P_T3_34) R17(IO_L19N_T3_VREF_34) R18(IO_L20N_T3_34) R19(IO_0_34) T10(IO_L1N_T0_34) T11(IO_L1P_T0_34) T12(IO_L2P_T0_34) T14(IO_L5P_T0_34) T15(IO_L5N_T0_34) T16(IO_L9P_T1_DQS_34) T17(IO_L20P_T3_34) U14(IO_L11P_T1_SRCC_34) U15(IO_L11N_T1_SRCC_34) U17(IO_L9N_T1_DQS_34) U18(IO_L12P_T1_MRCC_34) V15(IO_L10P_T1_34) V18(IO_L21N_T3_DQS_34)

### Layout directives
net class PL_B34: NPUDC, PL_B34_IO_25, PL_B34_L2_N, PL_B34_L3_N, PL_B34_L4_N, PL_B34_L4_P, PL_B34_L7_N, PL_B34_L7_P, PL_B34_L8_N, PL_B34_L8_P, PL_B34_L10_N, PL_B34_L12_N, PL_B34_L15_N, PL_B34_L16_N, PL_B34_L16_P, PL_B34_L17_N, PL_B34_L17_P, PL_B34_L18_N, PL_B34_L18_P, PL_B34_L21_P, PL_B34_L22_N, PL_B34_L22_P, PL_USER_LED_BLUE, PL_USER_LED_GREEN, PL_USER_LED_RED
net class PL_B35: PL_B35_L5_P, PL_B35_L10_N, PL_B35_L14_P, PL_B35_L15_N, PL_CLK_50MHZ

### Notes on the sheet
- ZYNQ-7000 SOM B'd (Rev.A)
- [6] ZYNQ Programmable Logic (PL)
- Pin Description : Refer to UG865 p12 (User I/O Pins)
- "PUDC_B" is for Pull-UP During Configuration (bar)
- if "PUDC_B" is Low, Internal pull-up resistors are enabled
- else if "PUDC_B" is High, Internal pull-up resistors are disabled
- Pin Description : Refer to UG865 p13 (PUDC_B)
- Title
- Rev
- Doc
- Sheet #
- of
- Author
- This document is copyright of ArkX and shall not be revealed, produced, copied, in whole or in part,
- Date
- nor used for any purpose other than submitted.
- (in symbol IC_SOC_XC7Z010-1CLG400I, part C) PL; BANK 34
- (in symbol IC_SOC_XC7Z010-1CLG400I, part D) PL; BANK 35

### Library data of the parts
C600 = CAP_100nF/16V/1005: Ceramic CAP_100nF/16V/1005; LCSC Part #: C1525; JLCPCB Part Type: Basic Part
C601 = CAP_4.7uF/10V/1005: as C301 on sheet 03_ZYNQ_Power; JLCPCB Part Type: Basic Part; LCSC Part #: C23733
LED600 = LED_RGB_MHT170RGBCT: as LED501 on sheet 05_ZYNQ_PS; LCSC Part #: C2962094; JLCPCB Part Type: Extended Part
R600 = RES_22R/1005/62.5mW: as R405 on sheet 04_ZYNQ_Config; Size: 1005; LCSC Part #: C25092; JLCPCB Part Type: Basic Part
R601-R603 = RES_470R/1005/62.5mW: as R508 on sheet 05_ZYNQ_PS; Size: 1005; LCSC Part #: C25117; JLCPCB Part Type: Basic Part
R604 = RES_1K/1005/62.5mW: as R419 on sheet 04_ZYNQ_Config; Size: 1005; LCSC Part #: C11702; JLCPCB Part Type: Basic Part
U300 = IC_SOC_XC7Z010-1CLG400I: as U300 on sheet 03_ZYNQ_Power; LCSC Part #: C2840994; JLCPCB Part Type: Extended Part
X600 = OSC_S2D50.000000B20F30T(50MHz): 3.3V 20mA ±30ppm CMOS 50MHz SMD2520-4P  Oscillators ROHS; LCSC Part #: C907626; JLCPCB Part Type: Extended Part

## Sheet 07_ZYNQ_DDR.SchDoc
size A3; SheetNumber: 7; SheetTotal: 9
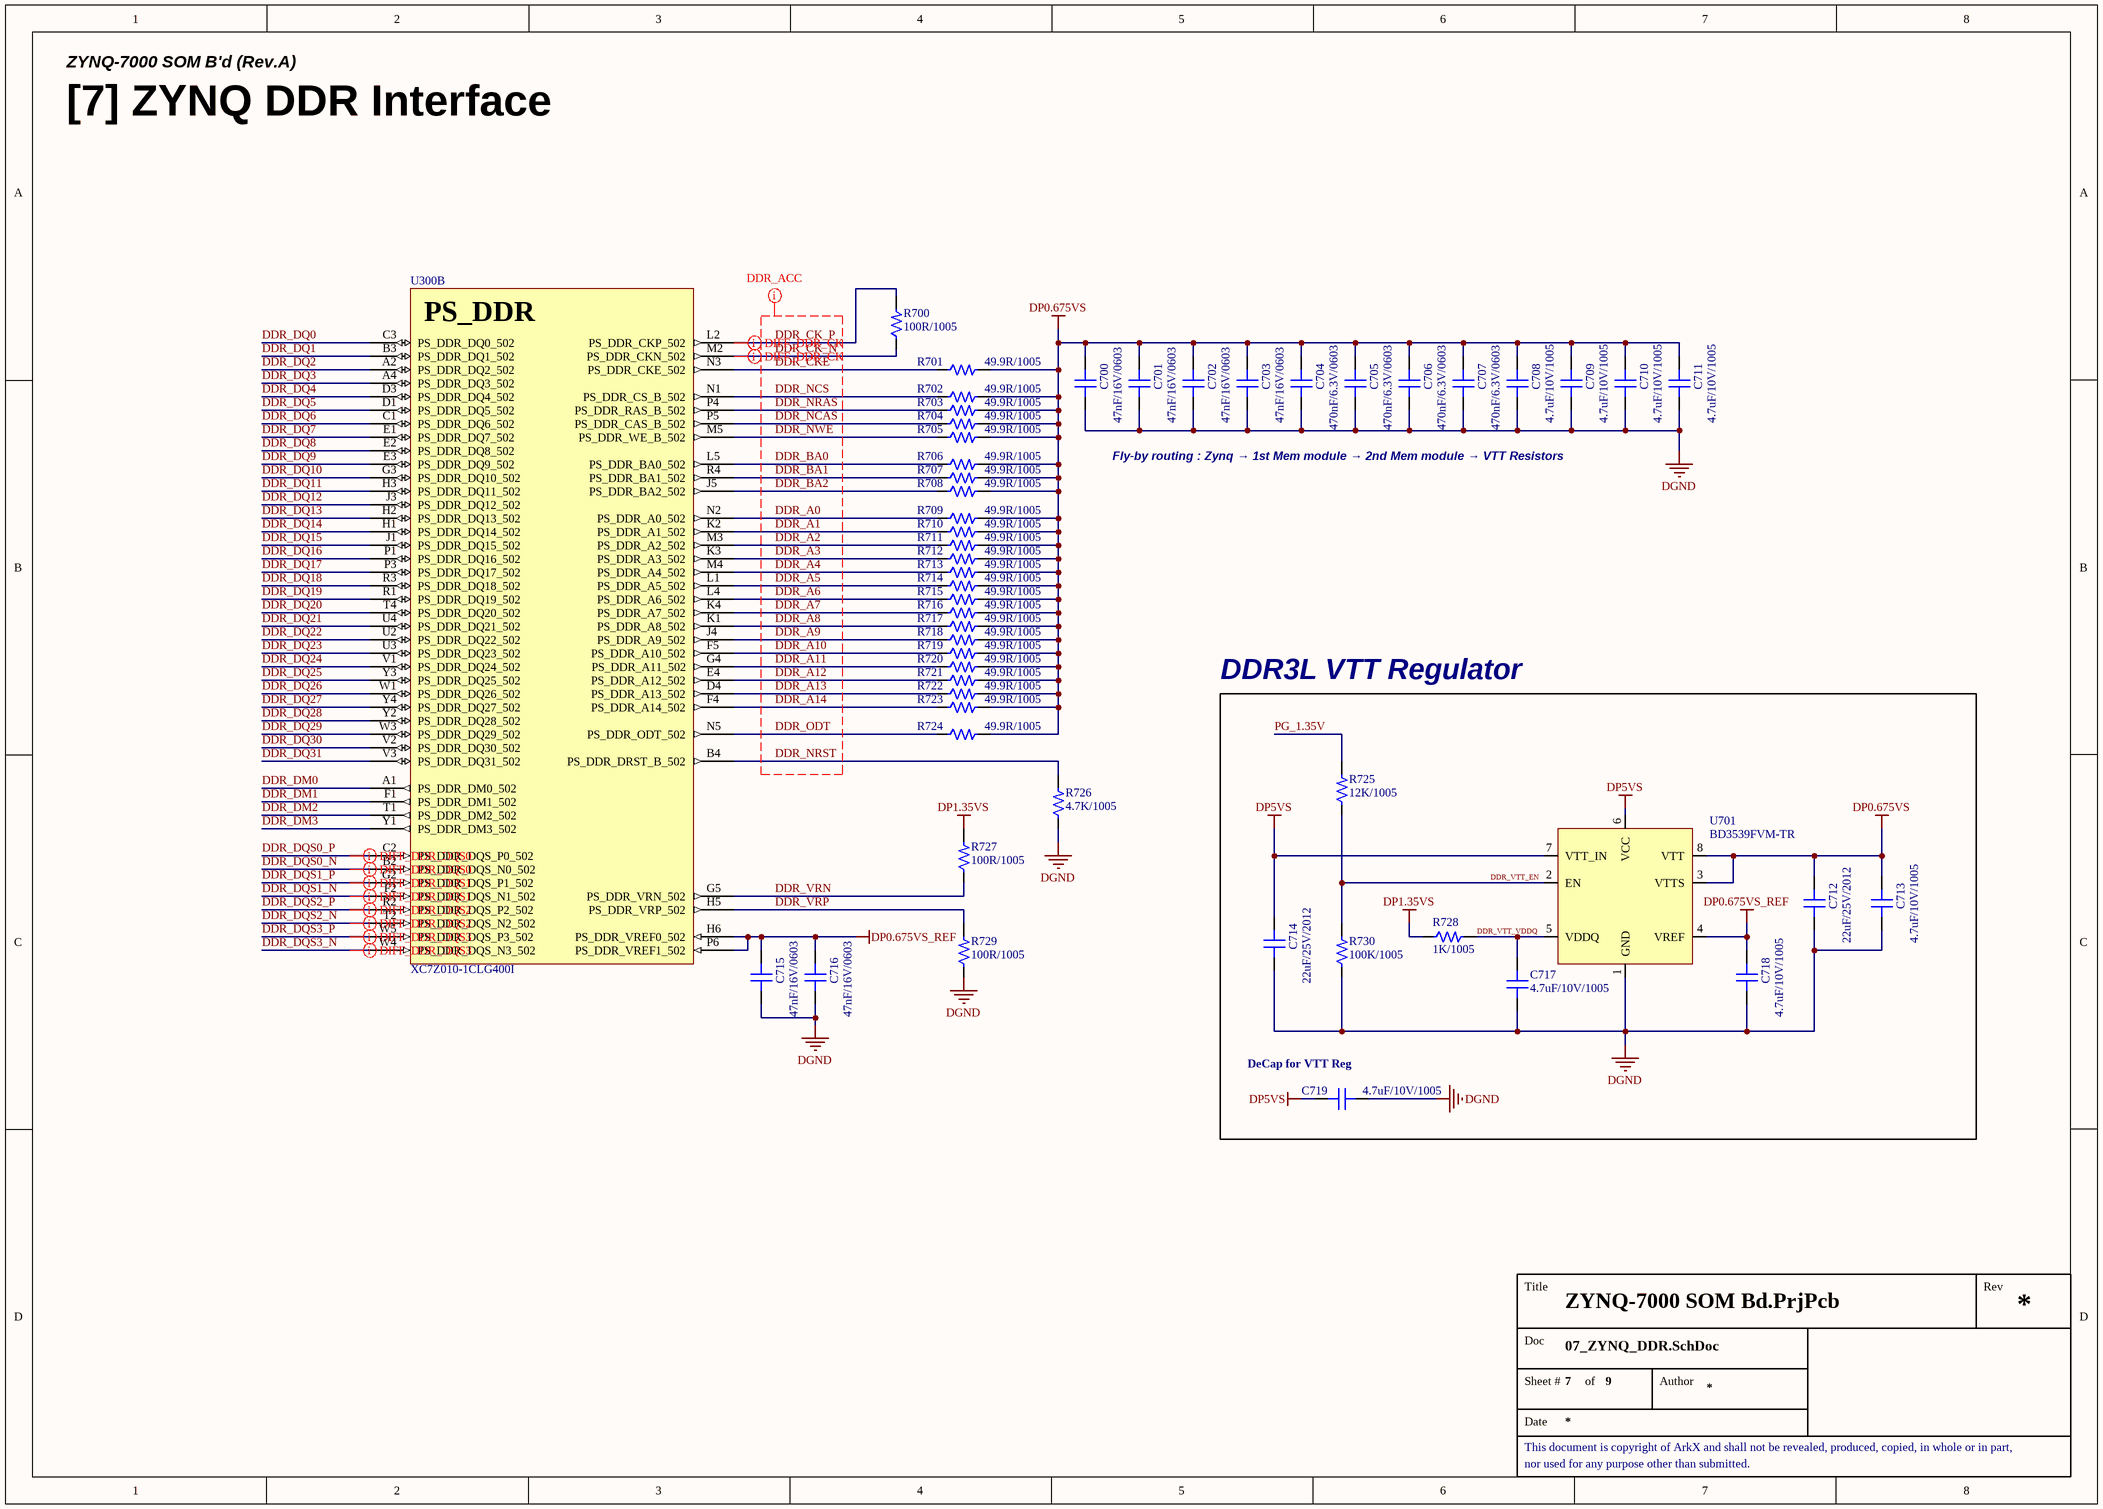
[diagram p6: 07_ZYNQ_DDR.SchDoc]

### Parts
C700  47nF/16V/0603  [CAP 0603 (0201_INCH)]
C701  47nF/16V/0603  [CAP 0603 (0201_INCH)]
C702  47nF/16V/0603  [CAP 0603 (0201_INCH)]
C703  47nF/16V/0603  [CAP 0603 (0201_INCH)]
C704  470nF/6.3V/0603  [CAP 0603 (0201_INCH)]
C705  470nF/6.3V/0603  [CAP 0603 (0201_INCH)]
C706  470nF/6.3V/0603  [CAP 0603 (0201_INCH)]
C707  470nF/6.3V/0603  [CAP 0603 (0201_INCH)]
C708  4.7uF/10V/1005  [CAP 1005 (0402_INCH)]
C709  4.7uF/10V/1005  [CAP 1005 (0402_INCH)]
C710  4.7uF/10V/1005  [CAP 1005 (0402_INCH)]
C711  4.7uF/10V/1005  [CAP 1005 (0402_INCH)]
C712  22uF/25V/2012  [CAP 2012 (0805_INCH)]
C713  4.7uF/10V/1005  [CAP 1005 (0402_INCH)]
C714  22uF/25V/2012  [CAP 2012 (0805_INCH)]
C715  47nF/16V/0603  [CAP 0603 (0201_INCH)]
C716  47nF/16V/0603  [CAP 0603 (0201_INCH)]
C717  4.7uF/10V/1005  [CAP 1005 (0402_INCH)]
C718  4.7uF/10V/1005  [CAP 1005 (0402_INCH)]
C719  4.7uF/10V/1005  [CAP 1005 (0402_INCH)]
R700  100R/1005  [RES 1005 (0402_inch)]
R701  49.9R/1005  [RES 1005 (0402_inch)]
R702  49.9R/1005  [RES 1005 (0402_inch)]
R703  49.9R/1005  [RES 1005 (0402_inch)]
R704  49.9R/1005  [RES 1005 (0402_inch)]
R705  49.9R/1005  [RES 1005 (0402_inch)]
R706  49.9R/1005  [RES 1005 (0402_inch)]
R707  49.9R/1005  [RES 1005 (0402_inch)]
R708  49.9R/1005  [RES 1005 (0402_inch)]
R709  49.9R/1005  [RES 1005 (0402_inch)]
R710  49.9R/1005  [RES 1005 (0402_inch)]
R711  49.9R/1005  [RES 1005 (0402_inch)]
R712  49.9R/1005  [RES 1005 (0402_inch)]
R713  49.9R/1005  [RES 1005 (0402_inch)]
R714  49.9R/1005  [RES 1005 (0402_inch)]
R715  49.9R/1005  [RES 1005 (0402_inch)]
R716  49.9R/1005  [RES 1005 (0402_inch)]
R717  49.9R/1005  [RES 1005 (0402_inch)]
R718  49.9R/1005  [RES 1005 (0402_inch)]
R719  49.9R/1005  [RES 1005 (0402_inch)]
R720  49.9R/1005  [RES 1005 (0402_inch)]
R721  49.9R/1005  [RES 1005 (0402_inch)]
R722  49.9R/1005  [RES 1005 (0402_inch)]
R723  49.9R/1005  [RES 1005 (0402_inch)]
R724  49.9R/1005  [RES 1005 (0402_inch)]
R725  12K/1005  [RES 1005 (0402_inch)]
R726  4.7K/1005  [RES 1005 (0402_inch)]
R727  100R/1005  [RES 1005 (0402_inch)]
R728  1K/1005  [RES 1005 (0402_inch)]
R729  100R/1005  [RES 1005 (0402_inch)]
R730  100K/1005  [RES 1005 (0402_inch)]
U300  XC7Z010-1CLG400I  [IC_SOC_XC7Z010-1CLG400I]  (part B of 9)
U701  BD3539FVM-TR  [IC_MSOP-8]

### Blocks framed on the sheet
DDR3L VTT Regulator: C712-C714 C717-C719 R725 R728 R730 U701

### Nets
DGND: C700.1 C701.1 C702.1 C703.1 C704.1 C705.1 C706.1 C707.1 C708.1 C709.1 C710.1 C711.1 C712.1 C713.1 C714.1 C715.1 C716.1 C717.1 C718.1 C719.2 R726.1 R729.1 R730.1 U701.1(GND)
DP0.675VS: C700.2 C701.2 C702.2 C703.2 C704.2 C705.2 C706.2 C707.2 C708.2 C709.2 C710.2 C711.2 C712.2 C713.2 R701.2 R702.2 R703.2 R704.2 R705.2 R706.2 R707.2 R708.2 R709.2 R710.2 R711.2 R712.2 R713.2 R714.2 R715.2 R716.2 R717.2 R718.2 R719.2 R720.2 R721.2 R722.2 R723.2 R724.2 U701.3(VTTS) U701.8(VTT)
DP0.675VS_REF: C715.2 C716.2 C718.2 U300.H6(PS_DDR_VREF0_502) U300.P6(PS_DDR_VREF1_502) U701.4(VREF)
DP1.35VS: R727.2 R728.1
DP5VS: C714.2 C719.1 U701.6(VCC) U701.7(VTT_IN)
DDR_A0: R709.1 U300.N2(PS_DDR_A0_502)
DDR_A1: R710.1 U300.K2(PS_DDR_A1_502)
DDR_A2: R711.1 U300.M3(PS_DDR_A2_502)
DDR_A3: R712.1 U300.K3(PS_DDR_A3_502)
DDR_A4: R713.1 U300.M4(PS_DDR_A4_502)
DDR_A5: R714.1 U300.L1(PS_DDR_A5_502)
DDR_A6: R715.1 U300.L4(PS_DDR_A6_502)
DDR_A7: R716.1 U300.K4(PS_DDR_A7_502)
DDR_A8: R717.1 U300.K1(PS_DDR_A8_502)
DDR_A9: R718.1 U300.J4(PS_DDR_A9_502)
DDR_A10: R719.1 U300.F5(PS_DDR_A10_502)
DDR_A11: R720.1 U300.G4(PS_DDR_A11_502)
DDR_A12: R721.1 U300.E4(PS_DDR_A12_502)
DDR_A13: R722.1 U300.D4(PS_DDR_A13_502)
DDR_A14: R723.1 U300.F4(PS_DDR_A14_502)
DDR_BA0: R706.1 U300.L5(PS_DDR_BA0_502)
DDR_BA1: R707.1 U300.R4(PS_DDR_BA1_502)
DDR_BA2: R708.1 U300.J5(PS_DDR_BA2_502)
DDR_CK_N: R700.1 U300.M2(PS_DDR_CKN_502)
DDR_CK_P: R700.2 U300.L2(PS_DDR_CKP_502)
DDR_CKE: R701.1 U300.N3(PS_DDR_CKE_502)
DDR_DM0: U300.A1(PS_DDR_DM0_502)
DDR_DM1: U300.F1(PS_DDR_DM1_502)
DDR_DM2: U300.T1(PS_DDR_DM2_502)
DDR_DM3: U300.Y1(PS_DDR_DM3_502)
DDR_DQ0: U300.C3(PS_DDR_DQ0_502)
DDR_DQ1: U300.B3(PS_DDR_DQ1_502)
DDR_DQ2: U300.A2(PS_DDR_DQ2_502)
DDR_DQ3: U300.A4(PS_DDR_DQ3_502)
DDR_DQ4: U300.D3(PS_DDR_DQ4_502)
DDR_DQ5: U300.D1(PS_DDR_DQ5_502)
DDR_DQ6: U300.C1(PS_DDR_DQ6_502)
DDR_DQ7: U300.E1(PS_DDR_DQ7_502)
DDR_DQ8: U300.E2(PS_DDR_DQ8_502)
DDR_DQ9: U300.E3(PS_DDR_DQ9_502)
DDR_DQ10: U300.G3(PS_DDR_DQ10_502)
DDR_DQ11: U300.H3(PS_DDR_DQ11_502)
DDR_DQ12: U300.J3(PS_DDR_DQ12_502)
DDR_DQ13: U300.H2(PS_DDR_DQ13_502)
DDR_DQ14: U300.H1(PS_DDR_DQ14_502)
DDR_DQ15: U300.J1(PS_DDR_DQ15_502)
DDR_DQ16: U300.P1(PS_DDR_DQ16_502)
DDR_DQ17: U300.P3(PS_DDR_DQ17_502)
DDR_DQ18: U300.R3(PS_DDR_DQ18_502)
DDR_DQ19: U300.R1(PS_DDR_DQ19_502)
DDR_DQ20: U300.T4(PS_DDR_DQ20_502)
DDR_DQ21: U300.U4(PS_DDR_DQ21_502)
DDR_DQ22: U300.U2(PS_DDR_DQ22_502)
DDR_DQ23: U300.U3(PS_DDR_DQ23_502)
DDR_DQ24: U300.V1(PS_DDR_DQ24_502)
DDR_DQ25: U300.Y3(PS_DDR_DQ25_502)
DDR_DQ26: U300.W1(PS_DDR_DQ26_502)
DDR_DQ27: U300.Y4(PS_DDR_DQ27_502)
DDR_DQ28: U300.Y2(PS_DDR_DQ28_502)
DDR_DQ29: U300.W3(PS_DDR_DQ29_502)
DDR_DQ30: U300.V2(PS_DDR_DQ30_502)
DDR_DQ31: U300.V3(PS_DDR_DQ31_502)
DDR_DQS0_N: U300.B2(PS_DDR_DQS_N0_502)
DDR_DQS0_P: U300.C2(PS_DDR_DQS_P0_502)
DDR_DQS1_N: U300.F2(PS_DDR_DQS_N1_502)
DDR_DQS1_P: U300.G2(PS_DDR_DQS_P1_502)
DDR_DQS2_N: U300.T2(PS_DDR_DQS_N2_502)
DDR_DQS2_P: U300.R2(PS_DDR_DQS_P2_502)
DDR_DQS3_N: U300.W4(PS_DDR_DQS_N3_502)
DDR_DQS3_P: U300.W5(PS_DDR_DQS_P3_502)
DDR_NCAS: R704.1 U300.P5(PS_DDR_CAS_B_502)
DDR_NCS: R702.1 U300.N1(PS_DDR_CS_B_502)
DDR_NRAS: R703.1 U300.P4(PS_DDR_RAS_B_502)
DDR_NRST: R726.2 U300.B4(PS_DDR_DRST_B_502)
DDR_NWE: R705.1 U300.M5(PS_DDR_WE_B_502)
DDR_ODT: R724.1 U300.N5(PS_DDR_ODT_502)
DDR_VRN: R727.1 U300.G5(PS_DDR_VRN_502)
DDR_VRP: R729.2 U300.H5(PS_DDR_VRP_502)
DDR_VTT_EN: R725.1 R730.2 U701.2(EN)
DDR_VTT_VDDQ: C717.2 R728.2 U701.5(VDDQ)
PG_1.35V: R725.2

### Layout directives
net class DDR_ACC; rule Matched Net Lengths [Delay Tolerance = 10ps]: DDR_A0, DDR_A1, DDR_A2, DDR_A3, DDR_A4, DDR_A5, DDR_A6, DDR_A7, DDR_A8, DDR_A9, DDR_A10, DDR_A11, DDR_A12, DDR_A13, DDR_A14, DDR_BA0, DDR_BA1, DDR_BA2, DDR_CK_N, DDR_CK_P, DDR_CKE, DDR_NCAS, DDR_NCS, DDR_NRAS, DDR_NRST, DDR_NWE, DDR_ODT
differential pair; differential pair class DIFF_DDR_CK: DDR_CK_N, DDR_CK_P
differential pair; differential pair class DIFF_DDR_DQS0: DDR_DQS0_N, DDR_DQS0_P
differential pair; differential pair class DIFF_DDR_DQS1: DDR_DQS1_N, DDR_DQS1_P
differential pair; differential pair class DIFF_DDR_DQS2: DDR_DQS2_N, DDR_DQS2_P
differential pair; differential pair class DIFF_DDR_DQS3: DDR_DQS3_N, DDR_DQS3_P

### Notes on the sheet
- ZYNQ-7000 SOM B'd (Rev.A)
- [7] ZYNQ DDR Interface
- Fly-by routing : Zynq → 1st Mem module → 2nd Mem module → VTT Resistors
- (near C719) DeCap for VTT Reg
- Title
- Rev
- Doc
- Sheet #
- of
- Author
- This document is copyright of ArkX and shall not be revealed, produced, copied, in whole or in part,
- Date
- nor used for any purpose other than submitted.
- (in symbol IC_SOC_XC7Z010-1CLG400I, part B) PS_DDR

### Library data of the parts
C700-C703 C715 C716 = CAP_47nF/16V/0603: 16V 47nF X5R ±10% 0201 Multilayer Ceramic Capacitors MLCC - SMD/SMT ROHS; JLCPCB Part Type: Extended Part; LCSC Part #: C88917
C704-C707 = CAP_470nF/6.3V/0603: as C300 on sheet 03_ZYNQ_Power; JLCPCB Part Type: Extended Part; LCSC Part #: C85926
C708-C711 C713 C717-C719 = CAP_4.7uF/10V/1005: as C301 on sheet 03_ZYNQ_Power; JLCPCB Part Type: Basic Part; LCSC Part #: C23733
C712 C714 = CAP_22uF/25V/2012: Ceramic CAP_22uF/25V/2012; LCSC Part #: C45783; JLCPCB Part Type: Basic Part
R700 R727 R729 = RES_100R/1005/62.5mW: Value: 100R; Power Rating: 62.5mW; Precision: 1%; Size: 1005; LCSC Part #: C25076; JLCPCB Part Type: Basic Part
R701-R724 = RES_49.9R/1005/62.5mW: Value: 49.9R; Power Rating: 62.5mW; Precision: 1%; Size: 1005; LCSC Part #: C25120; JLCPCB Part Type: Basic Part
R725 = RES_12K/1005/62.5mW: as R422 on sheet 04_ZYNQ_Config; Size: 1005; LCSC Part #: C25752; JLCPCB Part Type: Basic Part
R726 = RES_4.7K/1005/62.5mW: as R400 on sheet 04_ZYNQ_Config; Size: 1005; LCSC Part #: C25900; JLCPCB Part Type: Basic Part
R728 = RES_1K/1005/62.5mW: as R419 on sheet 04_ZYNQ_Config; Size: 1005; LCSC Part #: C11702; JLCPCB Part Type: Basic Part
R730 = RES_100K/1005/62.5mW: Value: 100K; Power Rating: 62.5mW; Precision: 1%; Size: 1005; LCSC Part #: C25741; JLCPCB Part Type: Basic Part
U300 = IC_SOC_XC7Z010-1CLG400I: as U300 on sheet 03_ZYNQ_Power; LCSC Part #: C2840994; JLCPCB Part Type: Extended Part
U701 = IC_REG_VTT_BD3539FVM-TR: 1.0V to 5.5V, 1A 1ch / Termination Regulators for DDR-SDRAMs, 8-MSOP; LCSC Part #: C213437; JLCPCB Part Type: Extended Part

## Sheet 08_DDR3L_Modules.SchDoc
size A3; SheetNumber: 8; SheetTotal: 9
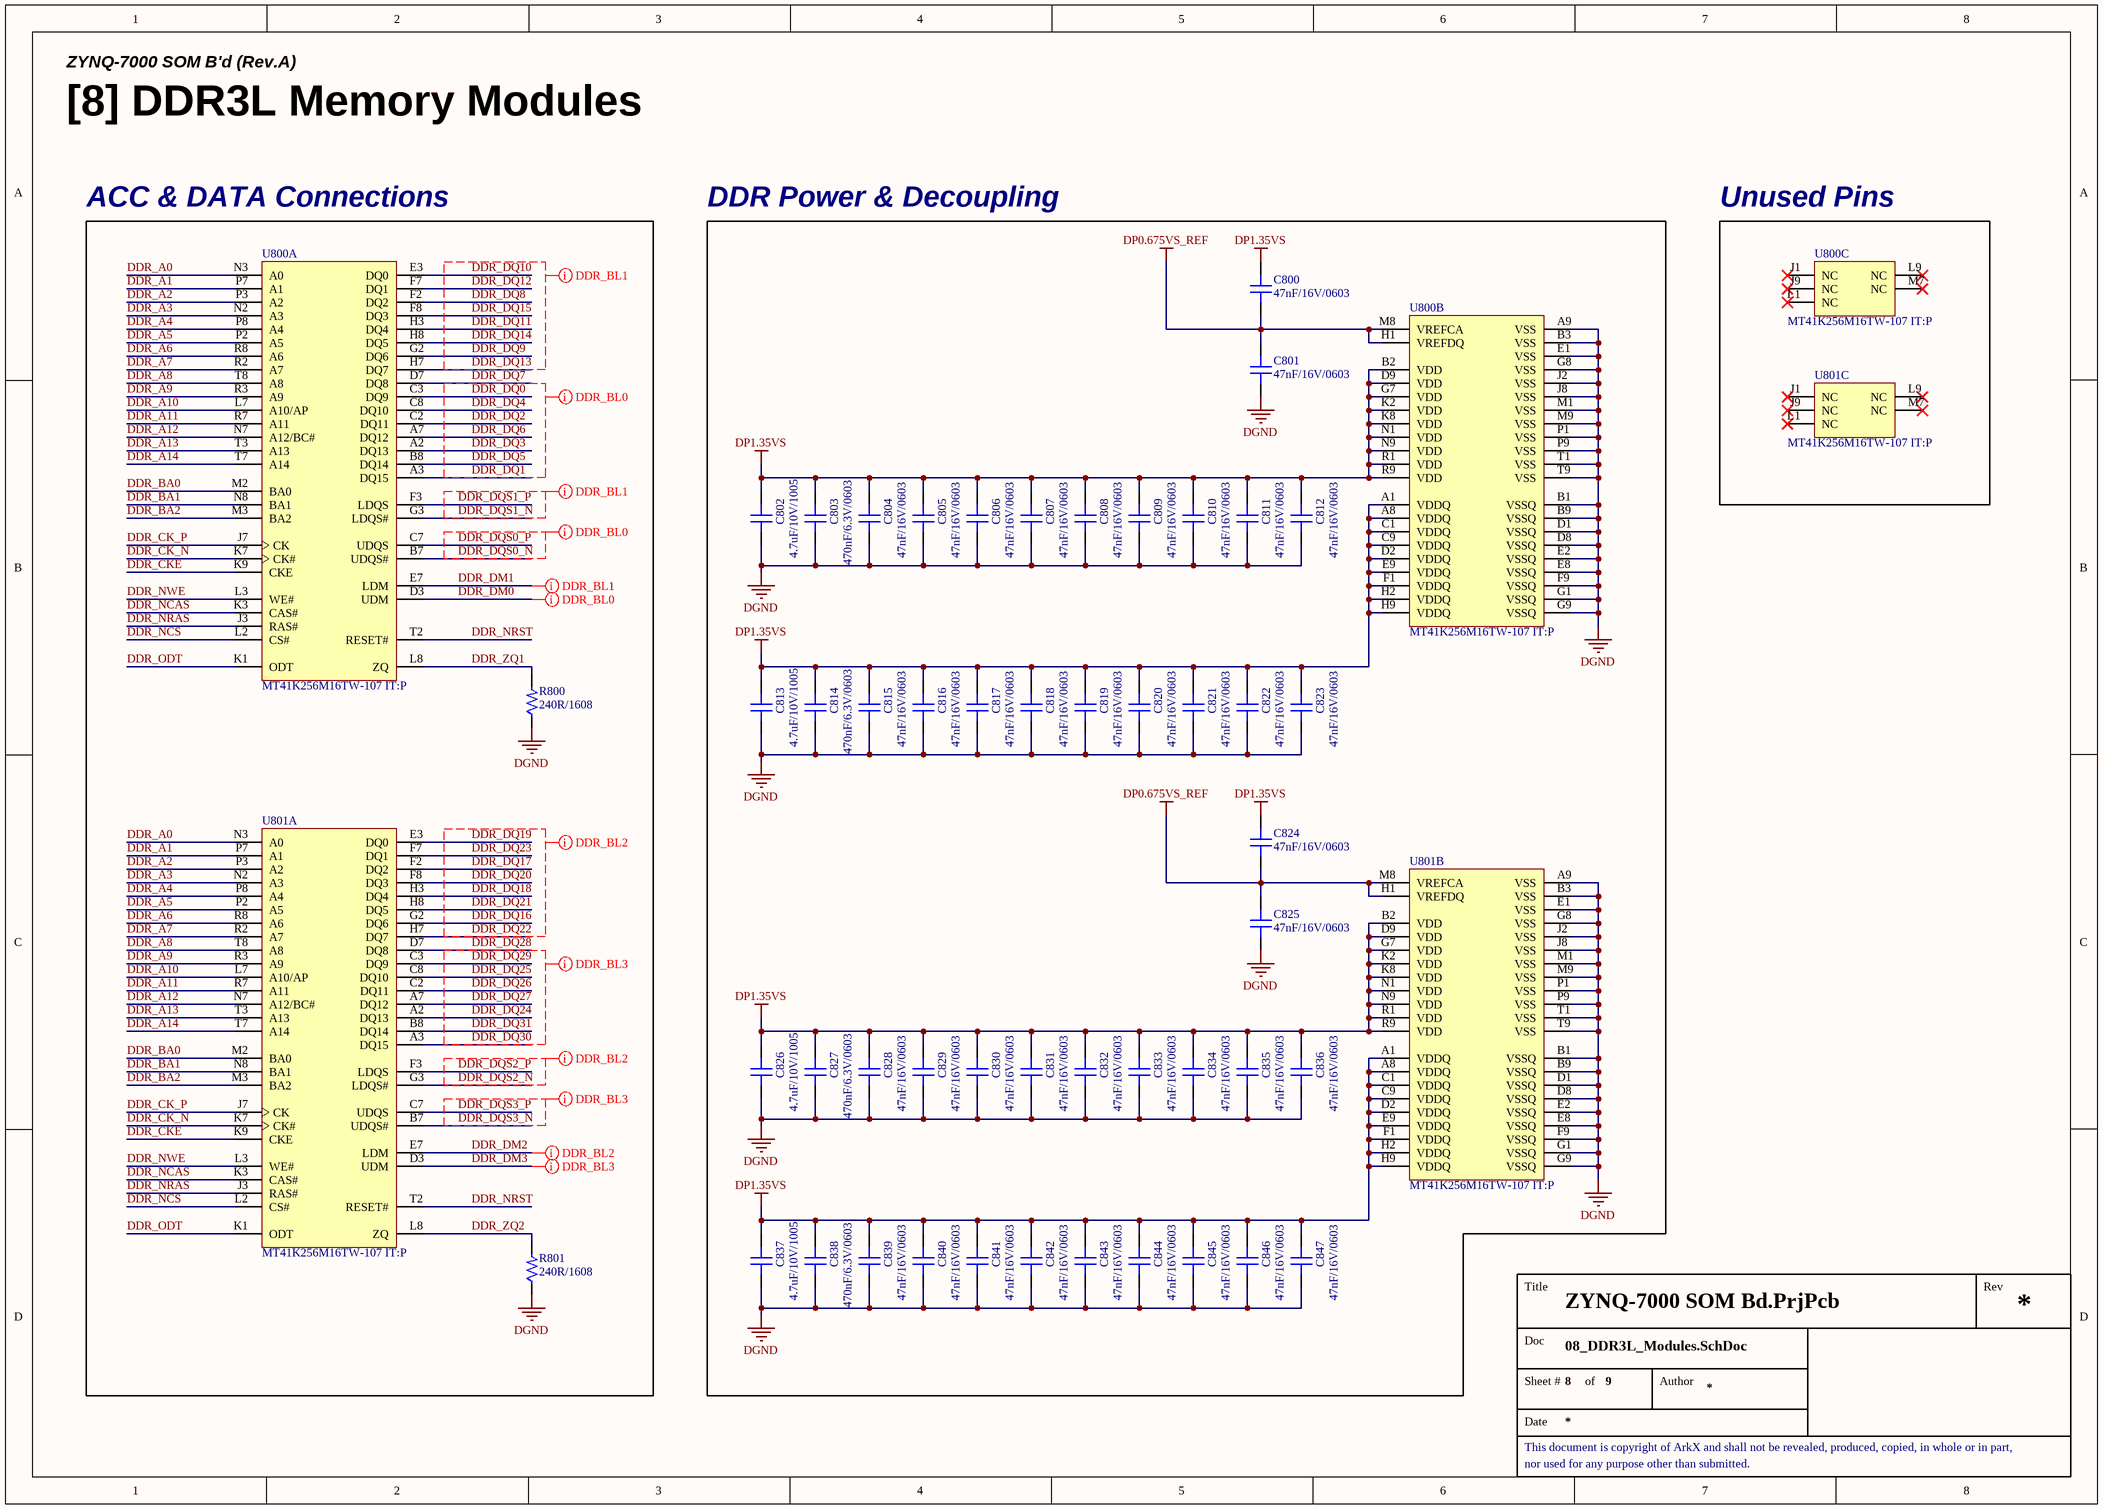
[diagram p7: 08_DDR3L_Modules.SchDoc]

### Parts
C800  47nF/16V/0603  [CAP 0603 (0201_INCH)]
C801  47nF/16V/0603  [CAP 0603 (0201_INCH)]
C802  4.7uF/10V/1005  [CAP 1005 (0402_INCH)]
C803  470nF/6.3V/0603  [CAP 0603 (0201_INCH)]
C804  47nF/16V/0603  [CAP 0603 (0201_INCH)]
C805  47nF/16V/0603  [CAP 0603 (0201_INCH)]
C806  47nF/16V/0603  [CAP 0603 (0201_INCH)]
C807  47nF/16V/0603  [CAP 0603 (0201_INCH)]
C808  47nF/16V/0603  [CAP 0603 (0201_INCH)]
C809  47nF/16V/0603  [CAP 0603 (0201_INCH)]
C810  47nF/16V/0603  [CAP 0603 (0201_INCH)]
C811  47nF/16V/0603  [CAP 0603 (0201_INCH)]
C812  47nF/16V/0603  [CAP 0603 (0201_INCH)]
C813  4.7uF/10V/1005  [CAP 1005 (0402_INCH)]
C814  470nF/6.3V/0603  [CAP 0603 (0201_INCH)]
C815  47nF/16V/0603  [CAP 0603 (0201_INCH)]
C816  47nF/16V/0603  [CAP 0603 (0201_INCH)]
C817  47nF/16V/0603  [CAP 0603 (0201_INCH)]
C818  47nF/16V/0603  [CAP 0603 (0201_INCH)]
C819  47nF/16V/0603  [CAP 0603 (0201_INCH)]
C820  47nF/16V/0603  [CAP 0603 (0201_INCH)]
C821  47nF/16V/0603  [CAP 0603 (0201_INCH)]
C822  47nF/16V/0603  [CAP 0603 (0201_INCH)]
C823  47nF/16V/0603  [CAP 0603 (0201_INCH)]
C824  47nF/16V/0603  [CAP 0603 (0201_INCH)]
C825  47nF/16V/0603  [CAP 0603 (0201_INCH)]
C826  4.7uF/10V/1005  [CAP 1005 (0402_INCH)]
C827  470nF/6.3V/0603  [CAP 0603 (0201_INCH)]
C828  47nF/16V/0603  [CAP 0603 (0201_INCH)]
C829  47nF/16V/0603  [CAP 0603 (0201_INCH)]
C830  47nF/16V/0603  [CAP 0603 (0201_INCH)]
C831  47nF/16V/0603  [CAP 0603 (0201_INCH)]
C832  47nF/16V/0603  [CAP 0603 (0201_INCH)]
C833  47nF/16V/0603  [CAP 0603 (0201_INCH)]
C834  47nF/16V/0603  [CAP 0603 (0201_INCH)]
C835  47nF/16V/0603  [CAP 0603 (0201_INCH)]
C836  47nF/16V/0603  [CAP 0603 (0201_INCH)]
C837  4.7uF/10V/1005  [CAP 1005 (0402_INCH)]
C838  470nF/6.3V/0603  [CAP 0603 (0201_INCH)]
C839  47nF/16V/0603  [CAP 0603 (0201_INCH)]
C840  47nF/16V/0603  [CAP 0603 (0201_INCH)]
C841  47nF/16V/0603  [CAP 0603 (0201_INCH)]
C842  47nF/16V/0603  [CAP 0603 (0201_INCH)]
C843  47nF/16V/0603  [CAP 0603 (0201_INCH)]
C844  47nF/16V/0603  [CAP 0603 (0201_INCH)]
C845  47nF/16V/0603  [CAP 0603 (0201_INCH)]
C846  47nF/16V/0603  [CAP 0603 (0201_INCH)]
C847  47nF/16V/0603  [CAP 0603 (0201_INCH)]
R800  240R/1608  [RES 1608 (0603_inch)]
R801  240R/1608  [RES 1608 (0603_inch)]
U800  MT41K256M16TW-107 IT:P  [IC_MEM_DDR3L_MT41K256M16TW-107 IT:P]  (parts A,B,C of 3)
U801  MT41K256M16TW-107 IT:P  [IC_MEM_DDR3L_MT41K256M16TW-107 IT:P]  (parts A,B,C of 3)

### Blocks framed on the sheet
ACC & DATA Connections: R800 R801 U800 U801
DDR Power & Decoupling: C800-C847 U800 U801
Unused Pins: U800 U801

### Nets
DGND: C801.1 C802.1 C803.1 C804.1 C805.1 C806.1 C807.1 C808.1 C809.1 C810.1 C811.1 C812.1 C813.1 C814.1 C815.1 C816.1 C817.1 C818.1 C819.1 C820.1 C821.1 C822.1 C823.1 C825.1 C826.1 C827.1 C828.1 C829.1 C830.1 C831.1 C832.1 C833.1 C834.1 C835.1 C836.1 C837.1 C838.1 C839.1 C840.1 C841.1 C842.1 C843.1 C844.1 C845.1 C846.1 C847.1 R800.1 R801.1 U800.A9(VSS) U800.B1(VSSQ) U800.B3(VSS) U800.B9(VSSQ) U800.D1(VSSQ) U800.D8(VSSQ) U800.E1(VSS) U800.E2(VSSQ) U800.E8(VSSQ) U800.F9(VSSQ) U800.G1(VSSQ) U800.G8(VSS) U800.G9(VSSQ) U800.J2(VSS) U800.J8(VSS) U800.M1(VSS) U800.M9(VSS) U800.P1(VSS) U800.P9(VSS) U800.T1(VSS) U800.T9(VSS) U801.A9(VSS) U801.B1(VSSQ) U801.B3(VSS) U801.B9(VSSQ) U801.D1(VSSQ) U801.D8(VSSQ) U801.E1(VSS) U801.E2(VSSQ) U801.E8(VSSQ) U801.F9(VSSQ) U801.G1(VSSQ) U801.G8(VSS) U801.G9(VSSQ) U801.J2(VSS) U801.J8(VSS) U801.M1(VSS) U801.M9(VSS) U801.P1(VSS) U801.P9(VSS) U801.T1(VSS) U801.T9(VSS)
DP0.675VS_REF: C800.1 C801.2 C824.1 C825.2 U800.H1(VREFDQ) U800.M8(VREFCA) U801.H1(VREFDQ) U801.M8(VREFCA)
DP1.35VS: C800.2 C802.2 C803.2 C804.2 C805.2 C806.2 C807.2 C808.2 C809.2 C810.2 C811.2 C812.2 C813.2 C814.2 C815.2 C816.2 C817.2 C818.2 C819.2 C820.2 C821.2 C822.2 C823.2 C824.2 C826.2 C827.2 C828.2 C829.2 C830.2 C831.2 C832.2 C833.2 C834.2 C835.2 C836.2 C837.2 C838.2 C839.2 C840.2 C841.2 C842.2 C843.2 C844.2 C845.2 C846.2 C847.2 U800.A1(VDDQ) U800.A8(VDDQ) U800.B2(VDD) U800.C1(VDDQ) U800.C9(VDDQ) U800.D2(VDDQ) U800.D9(VDD) U800.E9(VDDQ) U800.F1(VDDQ) U800.G7(VDD) U800.H2(VDDQ) U800.H9(VDDQ) U800.K2(VDD) U800.K8(VDD) U800.N1(VDD) U800.N9(VDD) U800.R1(VDD) U800.R9(VDD) U801.A1(VDDQ) U801.A8(VDDQ) U801.B2(VDD) U801.C1(VDDQ) U801.C9(VDDQ) U801.D2(VDDQ) U801.D9(VDD) U801.E9(VDDQ) U801.F1(VDDQ) U801.G7(VDD) U801.H2(VDDQ) U801.H9(VDDQ) U801.K2(VDD) U801.K8(VDD) U801.N1(VDD) U801.N9(VDD) U801.R1(VDD) U801.R9(VDD)
DDR_A0: U800.N3(A0) U801.N3(A0)
DDR_A1: U800.P7(A1) U801.P7(A1)
DDR_A2: U800.P3(A2) U801.P3(A2)
DDR_A3: U800.N2(A3) U801.N2(A3)
DDR_A4: U800.P8(A4) U801.P8(A4)
DDR_A5: U800.P2(A5) U801.P2(A5)
DDR_A6: U800.R8(A6) U801.R8(A6)
DDR_A7: U800.R2(A7) U801.R2(A7)
DDR_A8: U800.T8(A8) U801.T8(A8)
DDR_A9: U800.R3(A9) U801.R3(A9)
DDR_A10: U800.L7(A10/AP) U801.L7(A10/AP)
DDR_A11: U800.R7(A11) U801.R7(A11)
DDR_A12: U800.N7(A12/BC#) U801.N7(A12/BC#)
DDR_A13: U800.T3(A13) U801.T3(A13)
DDR_A14: U800.T7(A14) U801.T7(A14)
DDR_BA0: U800.M2(BA0) U801.M2(BA0)
DDR_BA1: U800.N8(BA1) U801.N8(BA1)
DDR_BA2: U800.M3(BA2) U801.M3(BA2)
DDR_CK_N: U800.K7(CK#) U801.K7(CK#)
DDR_CK_P: U800.J7(CK) U801.J7(CK)
DDR_CKE: U800.K9(CKE) U801.K9(CKE)
DDR_DM0: U800.D3(UDM)
DDR_DM1: U800.E7(LDM)
DDR_DM2: U801.E7(LDM)
DDR_DM3: U801.D3(UDM)
DDR_DQ0: U800.C3(DQ9)
DDR_DQ1: U800.A3(DQ15)
DDR_DQ2: U800.C2(DQ11)
DDR_DQ3: U800.A2(DQ13)
DDR_DQ4: U800.C8(DQ10)
DDR_DQ5: U800.B8(DQ14)
DDR_DQ6: U800.A7(DQ12)
DDR_DQ7: U800.D7(DQ8)
DDR_DQ8: U800.F2(DQ2)
DDR_DQ9: U800.G2(DQ6)
DDR_DQ10: U800.E3(DQ0)
DDR_DQ11: U800.H3(DQ4)
DDR_DQ12: U800.F7(DQ1)
DDR_DQ13: U800.H7(DQ7)
DDR_DQ14: U800.H8(DQ5)
DDR_DQ15: U800.F8(DQ3)
DDR_DQ16: U801.G2(DQ6)
DDR_DQ17: U801.F2(DQ2)
DDR_DQ18: U801.H3(DQ4)
DDR_DQ19: U801.E3(DQ0)
DDR_DQ20: U801.F8(DQ3)
DDR_DQ21: U801.H8(DQ5)
DDR_DQ22: U801.H7(DQ7)
DDR_DQ23: U801.F7(DQ1)
DDR_DQ24: U801.A2(DQ13)
DDR_DQ25: U801.C8(DQ10)
DDR_DQ26: U801.C2(DQ11)
DDR_DQ27: U801.A7(DQ12)
DDR_DQ28: U801.D7(DQ8)
DDR_DQ29: U801.C3(DQ9)
DDR_DQ30: U801.A3(DQ15)
DDR_DQ31: U801.B8(DQ14)
DDR_DQS0_N: U800.B7(UDQS#)
DDR_DQS0_P: U800.C7(UDQS)
DDR_DQS1_N: U800.G3(LDQS#)
DDR_DQS1_P: U800.F3(LDQS)
DDR_DQS2_N: U801.G3(LDQS#)
DDR_DQS2_P: U801.F3(LDQS)
DDR_DQS3_N: U801.B7(UDQS#)
DDR_DQS3_P: U801.C7(UDQS)
DDR_NCAS: U800.K3(CAS#) U801.K3(CAS#)
DDR_NCS: U800.L2(CS#) U801.L2(CS#)
DDR_NRAS: U800.J3(RAS#) U801.J3(RAS#)
DDR_NRST: U800.T2(RESET#) U801.T2(RESET#)
DDR_NWE: U800.L3(WE#) U801.L3(WE#)
DDR_ODT: U800.K1(ODT) U801.K1(ODT)
DDR_ZQ1: R800.2 U800.L8(ZQ)
DDR_ZQ2: R801.2 U801.L8(ZQ)

Not connected (* = marked no-connect by the designer): U800 J1(NC)* J9(NC)* L1(NC)* L9(NC)* M7(NC)*; U801 J1(NC)* J9(NC)* L1(NC)* L9(NC)* M7(NC)*

### Layout directives
net class DDR_BL0; rule Matched Net Lengths [Delay Tolerance = 10ps]: DDR_DM0, DDR_DQ0, DDR_DQ1, DDR_DQ2, DDR_DQ3, DDR_DQ4, DDR_DQ5, DDR_DQ6, DDR_DQ7, DDR_DQS0_N, DDR_DQS0_P
net class DDR_BL1; rule Matched Net Lengths [Delay Tolerance = 10ps]: DDR_DM1, DDR_DQ8, DDR_DQ9, DDR_DQ10, DDR_DQ11, DDR_DQ12, DDR_DQ13, DDR_DQ14, DDR_DQ15, DDR_DQS1_N, DDR_DQS1_P
net class DDR_BL2; rule Matched Net Lengths [Delay Tolerance = 10ps]: DDR_DM2, DDR_DQ16, DDR_DQ17, DDR_DQ18, DDR_DQ19, DDR_DQ20, DDR_DQ21, DDR_DQ22, DDR_DQ23, DDR_DQS2_N, DDR_DQS2_P
net class DDR_BL3; rule Matched Net Lengths [Delay Tolerance = 10ps]: DDR_DM3, DDR_DQ24, DDR_DQ25, DDR_DQ26, DDR_DQ27, DDR_DQ28, DDR_DQ29, DDR_DQ30, DDR_DQ31, DDR_DQS3_N, DDR_DQS3_P

### Notes on the sheet
- ZYNQ-7000 SOM B'd (Rev.A)
- [8] DDR3L Memory Modules
- Title
- Rev
- Doc
- Sheet #
- of
- Author
- This document is copyright of ArkX and shall not be revealed, produced, copied, in whole or in part,
- Date
- nor used for any purpose other than submitted.

### Library data of the parts
C800 C801 C804-C812 C815-C825 C828-C836 C839-C847 = CAP_47nF/16V/0603: as C700 on sheet 07_ZYNQ_DDR; JLCPCB Part Type: Extended Part; LCSC Part #: C88917
C802 C813 C826 C837 = CAP_4.7uF/10V/1005: as C301 on sheet 03_ZYNQ_Power; JLCPCB Part Type: Basic Part; LCSC Part #: C23733
C803 C814 C827 C838 = CAP_470nF/6.3V/0603: as C300 on sheet 03_ZYNQ_Power; JLCPCB Part Type: Extended Part; LCSC Part #: C85926
R800 R801 = RES_240R/1608/0.1W: Value: 240R; Power Rating: 0.1W; Precision: 1%; Size: 1608; LCSC Part #: C23350; JLCPCB Part Type: Basic Part
U800 U801 = IC_MEM_DDR3L_MT41K256M16TW-107 IT:P: SDRAM - DDR3L Memory IC 4Gbit Parallel 933 MHz 20 ns 96-FBGA (8x14); JLCPCB Part Type: Extended Part; LCSC Part #: C367428